# Altium project Motor Driver Board.PrjPcb
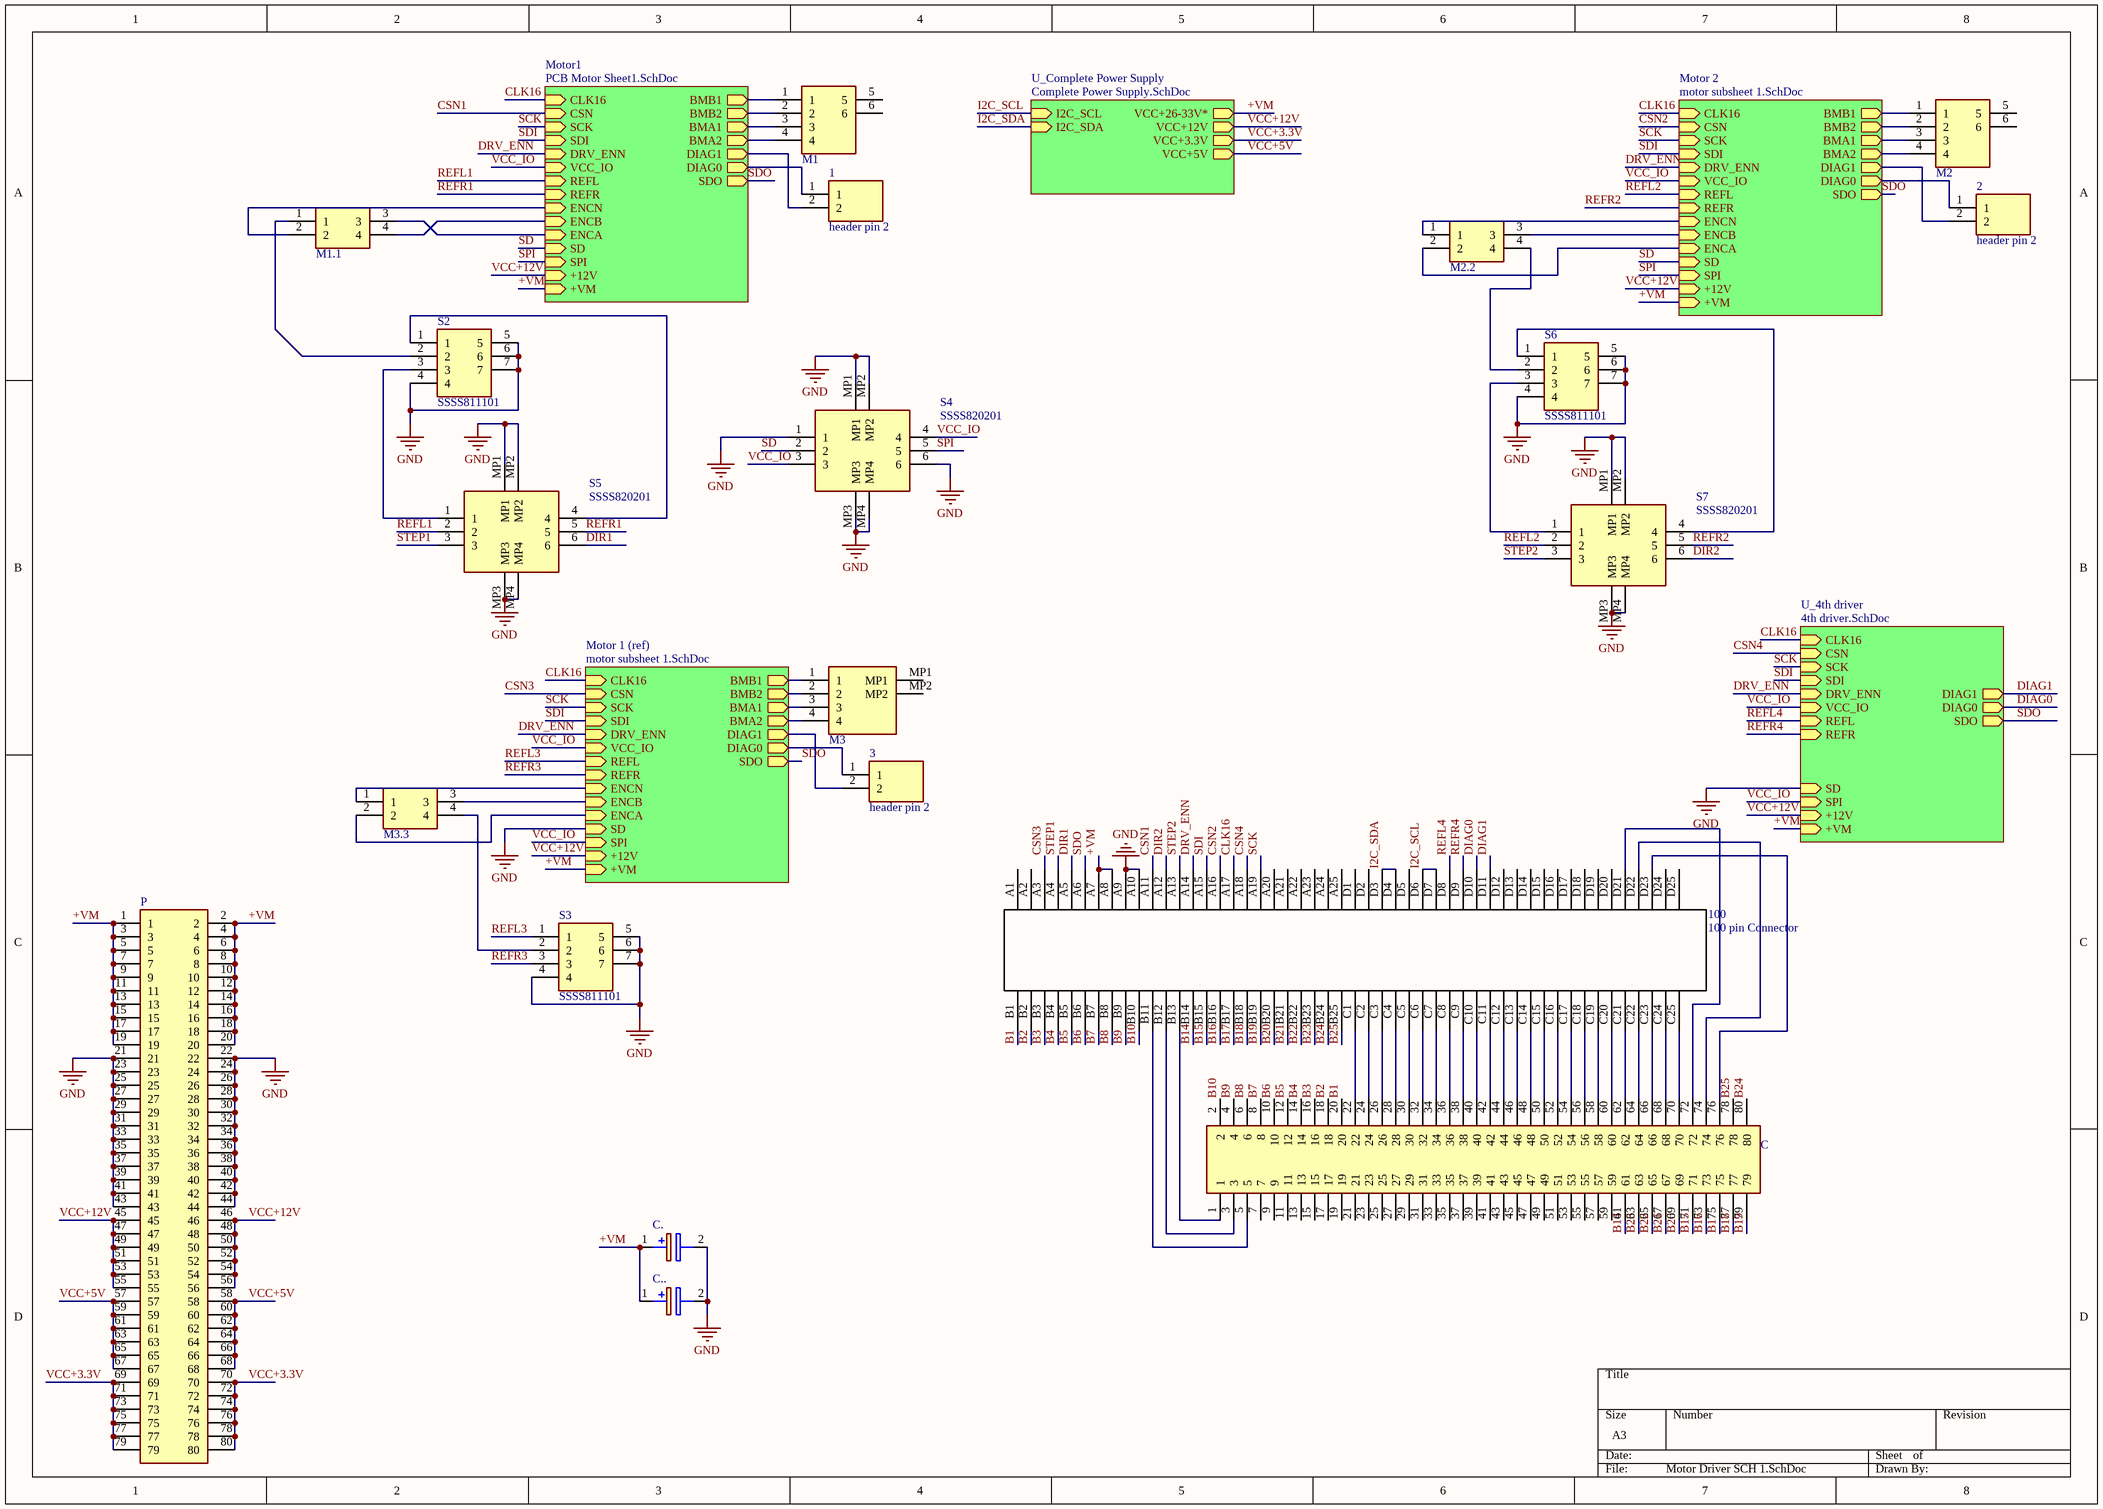
[diagram p0: Motor Driver SCH 1.SchDoc]
5 sheets, 214 parts. Net scope: hierarchical (ports join the sheet entries above them; power ports are global).
Board files: motor driver board PCB.PcbDoc, Dual Motor Driver.PcbDoc
Sheets:
  Motor Driver SCH 1.SchDoc
    Motor1 = PCB Motor Sheet1.SchDoc
    U_4th driver = 4th driver.SchDoc
    U_Complete Power Supply = Complete Power Supply.SchDoc
    Motor 2 = motor subsheet 1.SchDoc
    Motor 1 (ref) = motor subsheet 1.SchDoc

## Sheet Motor Driver SCH 1.SchDoc
size A3

### Parts
1  header pin 2  [2 pin header]
2  header pin 2  [2 pin header]
3  header pin 2  [2 pin header]
100  100 pin Connector  [SAMTEC_FOLC-125-M1-L-Q-LC]
C  5-5179180-3  [551791803]  (value not drawn)
C.  TPSD476M035R0300V  [CAPPM7344X310N]  (value not drawn)
C..  TPSD476M035R0300V  [CAPPM7344X310N]  (value not drawn)
M1  1778780  [1778780]  (value not drawn)
M1.1  SM04B-XSRS-ETB_LF__SN_  [SM04B-XSRS-ETB_2]  (value not drawn)
M2  1778780  [1778780]  (value not drawn)
M2.2  SM04B-XSRS-ETB_LF__SN_  [SM04B-XSRS-ETB_2]  (value not drawn)
M3  BM04B-ACHSS-A-GAN-TF_LF__SN_  [BM04BACHSSAGANTFLFSN]  (value not drawn)
M3.3  SM04B-XSRS-ETB_LF__SN_  [SM04B-XSRS-ETB_2]  (value not drawn)
P  5-5179180-3  [551791803]  (value not drawn)
S2  SSSS811101  [SSSS811101]
S3  SSSS811101  [SSSS811101]
S4  SSSS820201  [SSSS820201]
S5  SSSS820201  [SSSS820201]
S6  SSSS811101  [SSSS811101]
S7  SSSS820201  [SSSS820201]

### Sub-sheets
Motor1 = PCB Motor Sheet1.SchDoc: BMB1 (out), BMB2 (out), BMA1 (out), BMA2 (out), DIAG1 (out), DIAG0 (out), SDO (out), CLK16 (in), CSN (in), SCK (in), SDI (in), DRV_ENN (in), VCC_IO (in), REFL (in), REFR (in), ENCN (in), ENCB (in), ENCA (in), SD (in), +12V (in), +VM (in), SPI (in)
Motor 1 (ref) = motor subsheet 1.SchDoc: BMB1 (out), BMB2 (out), BMA1 (out), BMA2 (out), DIAG1 (out), DIAG0 (out), SDO (out), CLK16 (in), CSN (in), SCK (in), SDI (in), DRV_ENN (in), VCC_IO (in), REFL (in), REFR (in), ENCN (in), ENCB (in), ENCA (in), SD (in), +12V (in), +VM (in), SPI (in)
Motor 2 = motor subsheet 1.SchDoc: BMB1 (out), BMB2 (out), BMA1 (out), BMA2 (out), DIAG1 (out), DIAG0 (out), SDO (out), CLK16 (in), CSN (in), SCK (in), SDI (in), DRV_ENN (in), VCC_IO (in), REFL (in), REFR (in), ENCN (in), ENCB (in), ENCA (in), SD (in), +12V (in), +VM (in), SPI (in)
U_4th driver = 4th driver.SchDoc: DIAG1 (out), DIAG0 (out), SDO (out), CLK16 (in), CSN (in), SCK (in), SDI (in), DRV_ENN (in), VCC_IO (in), REFL (in), REFR (in), SD (in), +12V (in), +VM (in), SPI (in)
U_Complete Power Supply = Complete Power Supply.SchDoc: VCC+26-33V* (out), VCC+12V (out), VCC+3.3V (out), VCC+5V (out), I2C_SCL (in), I2C_SDA (in)

### Nets
+VM: 100.A7 100.A8 C..1(+) C...1(+) P.1 P.2 P.3 P.4 P.5 P.6 P.7 P.8 P.9 P.10 P.11 P.12 P.13 P.14 P.15 P.16 P.17 P.18 P.19 P.20 ; sheet Motor1/+VM, sheet U_4th driver/+VM, sheet U_Complete Power Supply/VCC+26-33V*, sheet Motor 2/+VM, sheet Motor 1 (ref)/+VM
GND: 100.A9 100.A10 C..2(-) C...2(-) P.21 P.22 P.23 P.24 P.25 P.26 P.27 P.28 P.29 P.30 P.31 P.32 P.33 P.34 P.35 P.36 P.37 P.38 P.39 P.40 P.41 P.42 P.43 P.44 S2.4 S2.5 S2.6 S2.7 S3.4 S3.5 S3.6 S3.7 S4.1 S4.6 S4.MP1 S4.MP2 S4.MP3 S4.MP4 S5.MP1 S5.MP2 S5.MP3 S5.MP4 S6.4 S6.5 S6.6 S6.7 S7.MP1 S7.MP2 S7.MP3 S7.MP4 ; sheet U_4th driver/SD, sheet Motor 1 (ref)/SD
VCC+3.3V: P.69 P.70 P.71 P.72 P.73 P.74 P.75 P.76 P.77 P.78 P.79 P.80 ; sheet U_Complete Power Supply/VCC+3.3V
VCC+5V: P.57 P.58 P.59 P.60 P.61 P.62 P.63 P.64 P.65 P.66 P.67 P.68 ; sheet U_Complete Power Supply/VCC+5V
VCC+12V: P.45 P.46 P.47 P.48 P.49 P.50 P.51 P.52 P.53 P.54 P.55 P.56 ; sheet Motor1/+12V, sheet U_4th driver/+12V, sheet U_Complete Power Supply/VCC+12V, sheet Motor 2/+12V, sheet Motor 1 (ref)/+12V
B1: 100.B1 C.20
B2: 100.B2 C.18
B3: 100.B3 C.16
B4: 100.B4 C.14
B5: 100.B5 C.12
B6: 100.B6 C.10
B7: 100.B7 C.8
B8: 100.B8 C.6
B9: 100.B9 C.4
B10: 100.B10 C.2
B14: 100.B14 C.61
B15: 100.B15 C.71
B16: 100.B16 C.73
B17: 100.B17 C.75
B18: 100.B18 C.77
B19: 100.B19 C.79
B20: 100.B20 C.69
B21: 100.B21 C.67
B22: 100.B22 C.65
B23: 100.B23 C.63
B24: 100.B24 C.80
B25: 100.B25 C.78
BMA1: M3.3 ; sheet Motor 1 (ref)/BMA1
BMA1: M1.3 ; sheet Motor1/BMA1  [a separate net that carries the same name]
BMA1: M2.3 ; sheet Motor 2/BMA1  [a separate net that carries the same name]
BMA2: M3.4 ; sheet Motor 1 (ref)/BMA2
BMA2: M1.4 ; sheet Motor1/BMA2  [a separate net that carries the same name]
BMA2: M2.4 ; sheet Motor 2/BMA2  [a separate net that carries the same name]
BMB1: M3.1 ; sheet Motor 1 (ref)/BMB1
BMB1: M1.1 ; sheet Motor1/BMB1  [a separate net that carries the same name]
BMB1: M2.1 ; sheet Motor 2/BMB1  [a separate net that carries the same name]
BMB2: M3.2 ; sheet Motor 1 (ref)/BMB2
BMB2: M1.2 ; sheet Motor1/BMB2  [a separate net that carries the same name]
BMB2: M2.2 ; sheet Motor 2/BMB2  [a separate net that carries the same name]
CLK16: 100.A17 ; sheet Motor1/CLK16, sheet U_4th driver/CLK16, sheet Motor 2/CLK16, sheet Motor 1 (ref)/CLK16
CSN1: 100.A11 ; sheet Motor1/CSN
CSN2: 100.A16 ; sheet Motor 2/CSN
CSN3: 100.A3 ; sheet Motor 1 (ref)/CSN
CSN4: 100.A18 ; sheet U_4th driver/CSN
DIAG0: 100.D10 ; sheet U_4th driver/DIAG0
DIAG1: 100.D11 ; sheet U_4th driver/DIAG1
DIR1: 100.A5 S5.6
DIR2: 100.A12 S7.6
DRV_ENN: 100.A14 ; sheet Motor1/DRV_ENN, sheet U_4th driver/DRV_ENN, sheet Motor 2/DRV_ENN, sheet Motor 1 (ref)/DRV_ENN
I2C_SCL: 100.D6 100.D7 ; sheet U_Complete Power Supply/I2C_SCL
I2C_SDA: 100.D3 100.D4 ; sheet U_Complete Power Supply/I2C_SDA
REFL1: S5.2 ; sheet Motor1/REFL
REFL2: S7.2 ; sheet Motor 2/REFL
REFL3: S3.1 ; sheet Motor 1 (ref)/REFL
REFL4: 100.D8 ; sheet U_4th driver/REFL
REFR1: S5.5 ; sheet Motor1/REFR
REFR2: S7.5 ; sheet Motor 2/REFR
REFR3: S3.3 ; sheet Motor 1 (ref)/REFR
REFR4: 100.D9 ; sheet U_4th driver/REFR
SCK: 100.A19 ; sheet Motor1/SCK, sheet U_4th driver/SCK, sheet Motor 2/SCK, sheet Motor 1 (ref)/SCK
SD: S4.2 ; sheet Motor1/SD, sheet Motor 2/SD
SDI: 100.A15 ; sheet Motor1/SDI, sheet U_4th driver/SDI, sheet Motor 2/SDI, sheet Motor 1 (ref)/SDI
SDO: 100.A6 ; sheet Motor1/SDO, sheet U_4th driver/SDO, sheet Motor 2/SDO, sheet Motor 1 (ref)/SDO
SPI: S4.5 ; sheet Motor1/SPI, sheet Motor 2/SPI
STEP1: 100.A4 S5.3
STEP2: 100.A13 S7.3
VCC_IO: S4.3 S4.4 ; sheet Motor1/VCC_IO, sheet U_4th driver/VCC_IO, sheet U_4th driver/SPI, sheet Motor 2/VCC_IO, sheet Motor 1 (ref)/VCC_IO, sheet Motor 1 (ref)/SPI
Net1_1: 1.1 ; sheet Motor1/DIAG0
Net1_2: 1.2 ; sheet Motor1/DIAG1
Net2_1: 2.1 ; sheet Motor 2/DIAG0
Net2_2: 2.2 ; sheet Motor 2/DIAG1
Net3_1: 3.1 ; sheet Motor 1 (ref)/DIAG0
Net3_2: 3.2 ; sheet Motor 1 (ref)/DIAG1
Net100_B11: 100.B11 C.5
Net100_B12: 100.B12 C.3
Net100_B13: 100.B13 C.1
Net100_C1: 100.C1 C.22
Net100_C2: 100.C2 C.24
Net100_C3: 100.C3 C.26
Net100_C4: 100.C4 C.28
Net100_C5: 100.C5 C.30
Net100_C6: 100.C6 C.32
Net100_C7: 100.C7 C.34
Net100_C8: 100.C8 C.36
Net100_C9: 100.C9 C.38
Net100_C10: 100.C10 C.40
Net100_C11: 100.C11 C.42
Net100_C12: 100.C12 C.44
Net100_C13: 100.C13 C.46
Net100_C14: 100.C14 C.48
Net100_C15: 100.C15 C.50
Net100_C16: 100.C16 C.52
Net100_C17: 100.C17 C.54
Net100_C18: 100.C18 C.56
Net100_C19: 100.C19 C.58
Net100_C20: 100.C20 C.60
Net100_C21: 100.C21 C.62
Net100_C22: 100.C22 C.64
Net100_C23: 100.C23 C.66
Net100_C24: 100.C24 C.68
Net100_C25: 100.C25 C.70
Net100_D21: 100.D21 C.72
Net100_D22: 100.D22 C.74
Net100_D23: 100.D23 C.76
NetIC1_23: M1.1.4 ; sheet Motor1/ENCB
NetIC1_24: M1.1.3 ; sheet Motor1/ENCA
NetIC1_25: M1.1.2 ; sheet Motor1/ENCN
NetIC1A_23: M2.2.3 ; sheet Motor 2/ENCB
NetIC1A_24: M2.2.2 ; sheet Motor 2/ENCA
NetIC1A_25: M2.2.1 ; sheet Motor 2/ENCN
NetIC1B_23: M3.3.3 ; sheet Motor 1 (ref)/ENCB
NetIC1B_24: M3.3.2 ; sheet Motor 1 (ref)/ENCA
NetIC1B_25: M3.3.1 ; sheet Motor 1 (ref)/ENCN
NetM1.1_1: M1.1.1 S2.2
NetM2.2_4: M2.2.4 S6.2
NetM3.3_4: M3.3.4 S3.2
NetS2_1: S2.1 S5.4
NetS2_3: S2.3 S5.1
NetS6_1: S6.1 S7.4
NetS6_3: S6.3 S7.1

Not connected (* = marked no-connect by the designer): 100 A1(26) A2(27) A20(45) A21(46) A22(47) A23(48) A24(49) A25(50) D1(101) D2(102) D5(105) D12(112) D13(113) D14(114) D15(115) D16(116) D17(117) D18(118) D19(119) D20(120) D24(124) D25(125); C 7 9 11 13 15 17 19 21 23 25 27 29 31 33 35 37 39 41 43 45 47 49 51 53 55 57 59; M1 5 6; M2 5 6; M3 MP1 MP2

### Library data of the parts
C P = 5-5179180-3: Connector; Manufacturer_Name: TE Connectivity; Datasheet Link: https://www.te.com/commerce/DocumentDelivery/DDEController?Action=showdoc&DocId=Customer+Drawing%7F5179180%7FD2%7Fpdf%7FEnglish%7FENG_CD_5179180_D2.pdf%7F5-5179180-3; Height: 8mm; Manufacturer_Part_Number: 5-5179180-3; Mouser Part Number: 571-5-5179180-3; Mouser Price/Stock: https://www.mouser.co.uk/ProductDetail/TE-Connectivity/5-5179180-3?qs=P2RFxj4culIYpw1CYdphOg%3D%3D; Arrow Part Number: 5-5179180-3; Arrow Price/Stock: https://www.arrow.com/en/products/5-5179180-3/te-connectivity
C. C.. = TPSD476M035R0300V: Capacitor Polarised; Manufacturer_Name: Kyocera AVX; Datasheet Link: https://componentsearchengine.com/Datasheets/2/TPSD476M035R0300V.pdf; Height: 3.1mm; Manufacturer_Part_Number: TPSD476M035R0300V; Mouser Part Number: 581-TPSD476M035R300V; Mouser Price/Stock: https://www.mouser.co.uk/ProductDetail/KYOCERA-AVX/TPSD476M035R0300V?qs=fAHHVMwC%252BbhHPnRCkY2ORg%3D%3D
M1 M2 = 1778780: Connector; Manufacturer_Name: Phoenix Contact; Datasheet Link: http://www.phoenixcontact.com/de/produkte/1778780/pdf; Height: 5.1mm; Manufacturer_Part_Number: 1778780; Mouser Part Number: 651-1778780; Mouser Price/Stock: https://www.mouser.co.uk/ProductDetail/Phoenix-Contact/1778780?qs=pYfYGt2amwkFYtacWTGMiw%3D%3D; Arrow Part Number: 1778780; Arrow Price/Stock: https://www.arrow.com/en/products/1778780/phoenix-contact?region=nac
M1.1 M2.2 M3.3 = SM04B-XSRS-ETB_LF__SN_: Connector; Manufacturer_Name: JST (JAPAN SOLDERLESS TERMINALS); Manufacturer_Part_Number: SM04B-XSRS-ETB(LF)(SN); Datasheet Link: https://datasheet.datasheetarchive.com/originals/distributors/Datasheets_SAMA/3d8b1bb9e73c0962bb93b166b87abb57.pdf
M3 = BM04B-ACHSS-A-GAN-TF_LF__SN_: Connector; Manufacturer_Name: JST (JAPAN SOLDERLESS TERMINALS); Manufacturer_Part_Number: BM04B-ACHSS-A-GAN-TF(LF)(SN); Datasheet Link: https://www.jst-mfg.com/product/pdf/eng/eACH.pdf; Height: 1.4mm
S2 S3 S6 = SSSS811101: Switch; Manufacturer_Name: ALPS Electric; Height: 1.6mm; Manufacturer_Part_Number: SSSS811101; Mouser Part Number: 688-SSSS811101; Mouser Price/Stock: https://www.mouser.co.uk/ProductDetail/Alps-Alpine/SSSS811101?qs=m0BA540hBPe%2FELmLcs%2FcCA%3D%3D; Arrow Part Number: SSSS811101; Arrow Price/Stock: https://www.arrow.com/en/products/ssss811101/alps-electric
S4 S5 S7 = SSSS820201: Switch; Manufacturer_Name: ALPS Electric; Datasheet Link: https://componentsearchengine.com/Datasheets/2/SSSS820201.pdf; Height: 2.9mm; Manufacturer_Part_Number: SSSS820201; Mouser Part Number: 688-SSSS820201; Mouser Price/Stock: https://www.mouser.co.uk/ProductDetail/Alps-Alpine/SSSS820201?qs=4nKZKRgDHlnI2QoAHm%252BpWA%3D%3D; Arrow Part Number: SSSS820201; Arrow Price/Stock: https://www.arrow.com/en/products/ssss820201/alps-electric?region=nac

## Sheet PCB Motor Sheet1.SchDoc
size A3
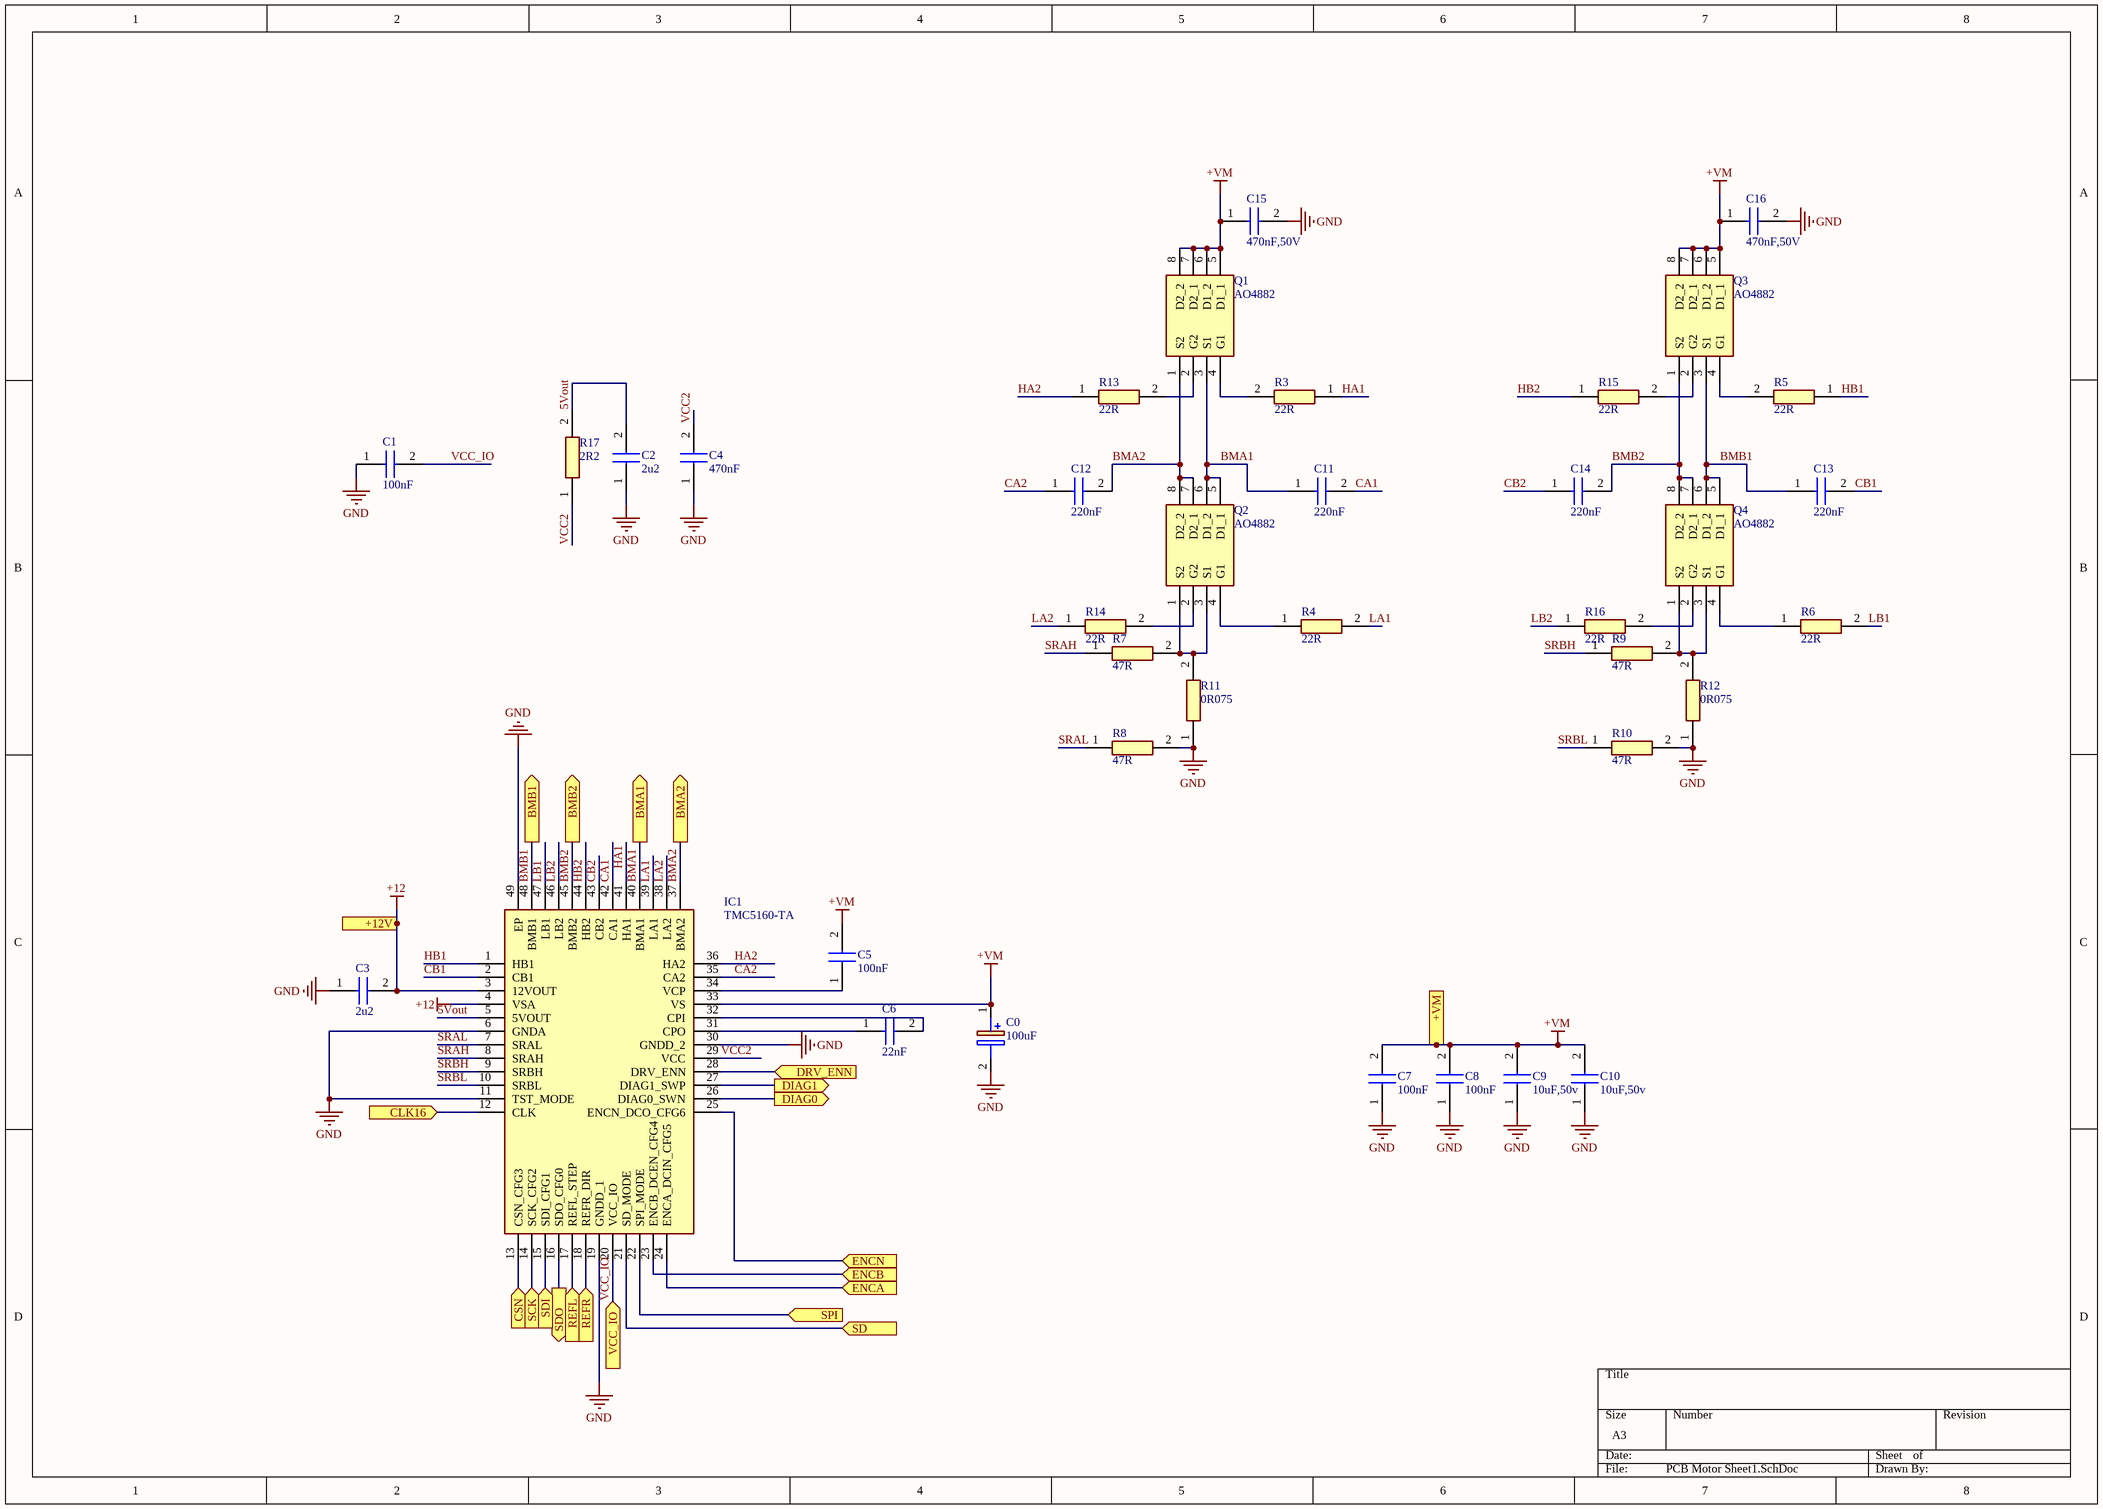
[diagram p1: PCB Motor Sheet1.SchDoc]

### Parts
C0  100uF  [CAPAE850X1050N]
C1  100nF  [CAPC1608X90N]
C2  2u2  [CAPC1608X90N]
C3  2u2  [CAPC1608X90N]
C4  470nF  [CAPC1608X90N]
C5  100nF  [CAPC1608X90N]
C6  22nF  [CAPC1608X90N]
C7  100nF  [CAPC1608X90N]
C8  100nF  [CAPC1608X90N]
C9  10uF,50v  [CAPC3216X180N]
C10  10uF,50v  [CAPC3216X180N]
C11  220nF  [CAPC1608X90N]
C12  220nF  [CAPC1608X90N]
C13  220nF  [CAPC1608X90N]
C14  220nF  [CAPC1608X90N]
C15  470nF,50V  [C1608_Commercial]
C16  470nF,50V  [C1608_Commercial]
IC1  TMC5160-TA  [QFP50P900X900X120-49N]
Q1  AO4882  [SOIC127P600X175-8N]
Q2  AO4882  [SOIC127P600X175-8N]
Q3  AO4882  [SOIC127P600X175-8N]
Q4  AO4882  [SOIC127P600X175-8N]
R3  22R  [RESC1608X55N]
R4  22R  [RESC1608X55N]
R5  22R  [RESC1608X55N]
R6  22R  [RESC1608X55N]
R7  47R  [RESC1608X60N]
R8  47R  [RESC1608X60N]
R9  47R  [RESC1608X60N]
R10  47R  [RESC1608X60N]
R11  0R075  [ERJ8_B_BW_R_LW_CW_D]
R12  0R075  [ERJ8_B_BW_R_LW_CW_D]
R13  22R  [RESC1608X55N]
R14  22R  [RESC1608X55N]
R15  22R  [RESC1608X55N]
R16  22R  [RESC1608X55N]
R17  2R2  [RESC1608X55N]

### Ports
+12V (in), +VM (in), BMA1 (out), BMA2 (out), BMB1 (out), BMB2 (out), CLK16 (in), CSN (in), DIAG0 (out), DIAG1 (out), DRV_ENN (in), ENCA (in), ENCB (in), ENCN (in), REFL (in), REFR (in), SCK (in), SD (in), SDI (in), SDO (out), SPI (in), VCC_IO (in)

### Nets
+12: C3.2 IC1.3(12VOUT) IC1.4(VSA) ; port +12V  [project net VCC+12V]
+VM: C0.1(+) C5.2 C7.2 C8.2 C9.2 C10.2 C15.1 C16.1 IC1.33(VS) Q1.5(D1_1) Q1.6(D1_2) Q1.7(D2_1) Q1.8(D2_2) Q3.5(D1_1) Q3.6(D1_2) Q3.7(D2_1) Q3.8(D2_2) ; port +VM
GND: C0.2(-) C1.1 C2.1 C3.1 C4.1 C7.1 C8.1 C9.1 C10.1 C15.2 C16.2 IC1.6(GNDA) IC1.11(TST_MODE) IC1.19(GNDD_1) IC1.30(GNDD_2) IC1.49(EP) R8.2 R10.2 R11.1 R12.1
5Vout: C2.2 IC1.5(5VOUT) R17.2
BMA1: C11.1 IC1.40(BMA1) Q1.3(S1) Q2.5(D1_1) Q2.6(D1_2) ; port BMA1
BMA2: C12.2 IC1.37(BMA2) Q1.1(S2) Q2.7(D2_1) Q2.8(D2_2) ; port BMA2
BMB1: C13.1 IC1.48(BMB1) Q3.3(S1) Q4.5(D1_1) Q4.6(D1_2) ; port BMB1
BMB2: C14.2 IC1.45(BMB2) Q3.1(S2) Q4.7(D2_1) Q4.8(D2_2) ; port BMB2
CA1: C11.2 IC1.42(CA1)
CA2: C12.1 IC1.35(CA2)
CB1: C13.2 IC1.2(CB1)
CB2: C14.1 IC1.43(CB2)
CLK16: IC1.12(CLK) ; port CLK16
CSN1: IC1.13(CSN_CFG3) ; port CSN
DRV_ENN: IC1.28(DRV_ENN) ; port DRV_ENN
HA1: IC1.41(HA1) R3.1
HA2: IC1.36(HA2) R13.1
HB1: IC1.1(HB1) R5.1
HB2: IC1.44(HB2) R15.1
LA1: IC1.39(LA1) R4.2
LA2: IC1.38(LA2) R14.1
LB1: IC1.47(LB1) R6.2
LB2: IC1.46(LB2) R16.1
REFL1: IC1.17(REFL_STEP) ; port REFL
REFR1: IC1.18(REFR_DIR) ; port REFR
SCK: IC1.14(SCK_CFG2) ; port SCK
SD: IC1.21(SD_MODE) ; port SD
SDI: IC1.15(SDI_CFG1) ; port SDI
SDO: IC1.16(SDO_CFG0) ; port SDO
SPI: IC1.22(SPI_MODE) ; port SPI
SRAH: IC1.8(SRAH) R7.1
SRAL: IC1.7(SRAL) R8.1
SRBH: IC1.9(SRBH) R9.1
SRBL: IC1.10(SRBL) R10.1
VCC2: C4.2 IC1.29(VCC) R17.1
VCC_IO: C1.2 IC1.20(VCC_IO) ; port VCC_IO
Net1_1: IC1.26(DIAG0_SWN) ; port DIAG0
Net1_2: IC1.27(DIAG1_SWP) ; port DIAG1
NetC5_1: C5.1 IC1.34(VCP)
NetC6_1: C6.1 IC1.31(CPO)
NetC6_2: C6.2 IC1.32(CPI)
NetIC1_23: IC1.23(ENCB_DCEN_CFG4) ; port ENCB
NetIC1_24: IC1.24(ENCA_DCIN_CFG5) ; port ENCA
NetIC1_25: IC1.25(ENCN_DCO_CFG6) ; port ENCN
NetQ1_2: Q1.2(G2) R13.2
NetQ1_4: Q1.4(G1) R3.2
NetQ2_1: Q2.1(S2) Q2.3(S1) R7.2 R11.2
NetQ2_2: Q2.2(G2) R14.2
NetQ2_4: Q2.4(G1) R4.1
NetQ3_2: Q3.2(G2) R15.2
NetQ3_4: Q3.4(G1) R5.2
NetQ4_1: Q4.1(S2) Q4.3(S1) R9.2 R12.2
NetQ4_2: Q4.2(G2) R16.2
NetQ4_4: Q4.4(G1) R6.1

### Library data of the parts
C0 = MAL215097011E3: Capacitor Polarised / MAL215097011E3; Manufacturer_Name: Vishay; Datasheet Link: http://www.vishay.com/docs/28395/150crz.pdf; Height: 10.5mm; Manufacturer_Part_Number: MAL215097011E3; Mouser Part Number: 594-MAL215097011E3; Mouser Price/Stock: https://www.mouser.co.uk/ProductDetail/Vishay-BC-Components/MAL215097011E3?qs=qmStTZH4TzmmMfVG5I6TQQ%3D%3D; Arrow Part Number: MAL215097011E3; Arrow Price/Stock: https://www.arrow.com/en/products/mal215097011e3/vishay
C1-C8 C11-C14 = GCM188R71H224KA64D: Capacitor; Manufacturer_Name: Murata Electronics; Datasheet Link: https://psearch.en.murata.com/capacitor/product/GCM188R71H224KA64%23.html; Height: 0.9mm; Manufacturer_Part_Number: GCM188R71H224KA64D; Mouser Part Number: 81-GCM188R71H224K64D; Mouser Price/Stock: https://www.mouser.co.uk/ProductDetail/Murata-Electronics/GCM188R71H224KA64D?qs=Kk8YaIHLBVBgtUYYs%2FZrtQ%3D%3D; Arrow Part Number: GCM188R71H224KA64D; Arrow Price/Stock: https://www.arrow.com/en/products/gcm188r71h224ka64d/murata-manufacturing
  C1 C5 C7 C8: LCSC Part #: C161181
  C2: LCSC Part #: C77047
  C3: LCSC Part #: *
  C4: LCSC Part #: C170149
  C6: LCSC Part #: C354353
  C11-C14: LCSC Part #: C97857
C9 C10 = GRM31CR61H106MA12L: Capacitor; Manufacturer_Name: Murata Electronics; Datasheet Link: https://datasheet.datasheetarchive.com/originals/distributors/DKDS-10/192395.pdf; Height: 1.8mm; Manufacturer_Part_Number: GRM31CR61H106MA12L; Mouser Part Number: 81-GRM31CR61H106MA2L; Mouser Price/Stock: https://www.mouser.co.uk/ProductDetail/Murata-Electronics/GRM31CR61H106MA12L/?qs=eeBpzGFlv%252B9KISFXBDHybg%3D%3D; Arrow Part Number: GRM31CR61H106MA12L; Arrow Price/Stock: https://www.arrow.com/en/products/grm31cr61h106ma12l/murata-manufacturing?region=europe; LCSC Part #: C882507
C15 C16 = C1608X7R1H474K080AC: Capacitor; Manufacturer_Name: TDK; Datasheet Link: https://product.tdk.com/system/files/dam/doc/product/capacitor/ceramic/mlcc/catalog/mlcc_commercial_general_en.pdf; Height: 0.9mm; Manufacturer_Part_Number: C1608X7R1H474K080AC; Mouser Part Number: 810-C1608X7R1H474K; Mouser Price/Stock: https://www.mouser.co.uk/ProductDetail/TDK/C1608X7R1H474K080AC?qs=NRhsANhppD8WKA9kPBtdag%3D%3D; LCSC Part #: C170149
IC1 = TMC5160-TA: Integrated Circuit; Manufacturer_Name: TRINAMIC; Datasheet Link: https://datasheet.datasheetarchive.com/originals/distributors/DKDS-40/47761.pdf; Height: 1.2mm; Manufacturer_Part_Number: TMC5160-TA; LCSC Part #: C516354
Q1-Q4 = AO4882: MOSFET (N-Channel); Manufacturer_Name: Alpha & Omega Semiconductors; Datasheet Link: http://www.aosmd.com/res/data_sheets/AO4882.pdf; Height: 1.75mm; Manufacturer_Part_Number: AO4882; Arrow Part Number: AO4882; Arrow Price/Stock: https://www.arrow.com/en/products/ao4882/alpha-and-omega-semiconductor?region=nac; LCSC Part #: C3040598
R3-R6 R13-R17 = MC0063W06031100K: Resistor; Manufacturer_Name: MULTICOMP; Datasheet Link: http://uk.farnell.com/multicomp/mc0063w06031105k/res-thick-film-105k-1-0-063w-0603/dp/1170988; Height: 0.55mm; Manufacturer_Part_Number: MC0063W06031100K
  R3-R6 R13-R16: LCSC Part #: C122707
  R17: LCSC Part #: C269422
R7-R10 = MCSR06X47R0FTL: Resistor; Manufacturer_Name: MULTICOMP; Datasheet Link: http://www.farnell.com/datasheets/1716710.pdf?_ga=1.256651403.1411154270.1472651675; Height: 0.6mm; Manufacturer_Part_Number: MCSR06X47R0FTL; LCSC Part #: C2136913
R11 R12 = ERJ-8BWFR075V: Resistor; Manufacturer_Name: Panasonic; Datasheet Link: http://industrial.panasonic.com/cdbs/www-data/pdf/RDN0000/AOA0000C313.pdf; Manufacturer_Part_Number: ERJ-8BWFR075V; Mouser Part Number: 667-ERJ-8BWFR075V; Mouser Price/Stock: https://www.mouser.co.uk/ProductDetail/Panasonic/ERJ-8BWFR075V?qs=KH2o3k57USiX44P74%2FQfRA%3D%3D; Arrow Part Number: ERJ-8BWFR075V; Arrow Price/Stock: https://www.arrow.com/en/products/erj-8bwfr075v/panasonic; LCSC Part #: C388441

## Sheet 4th driver.SchDoc
size A3
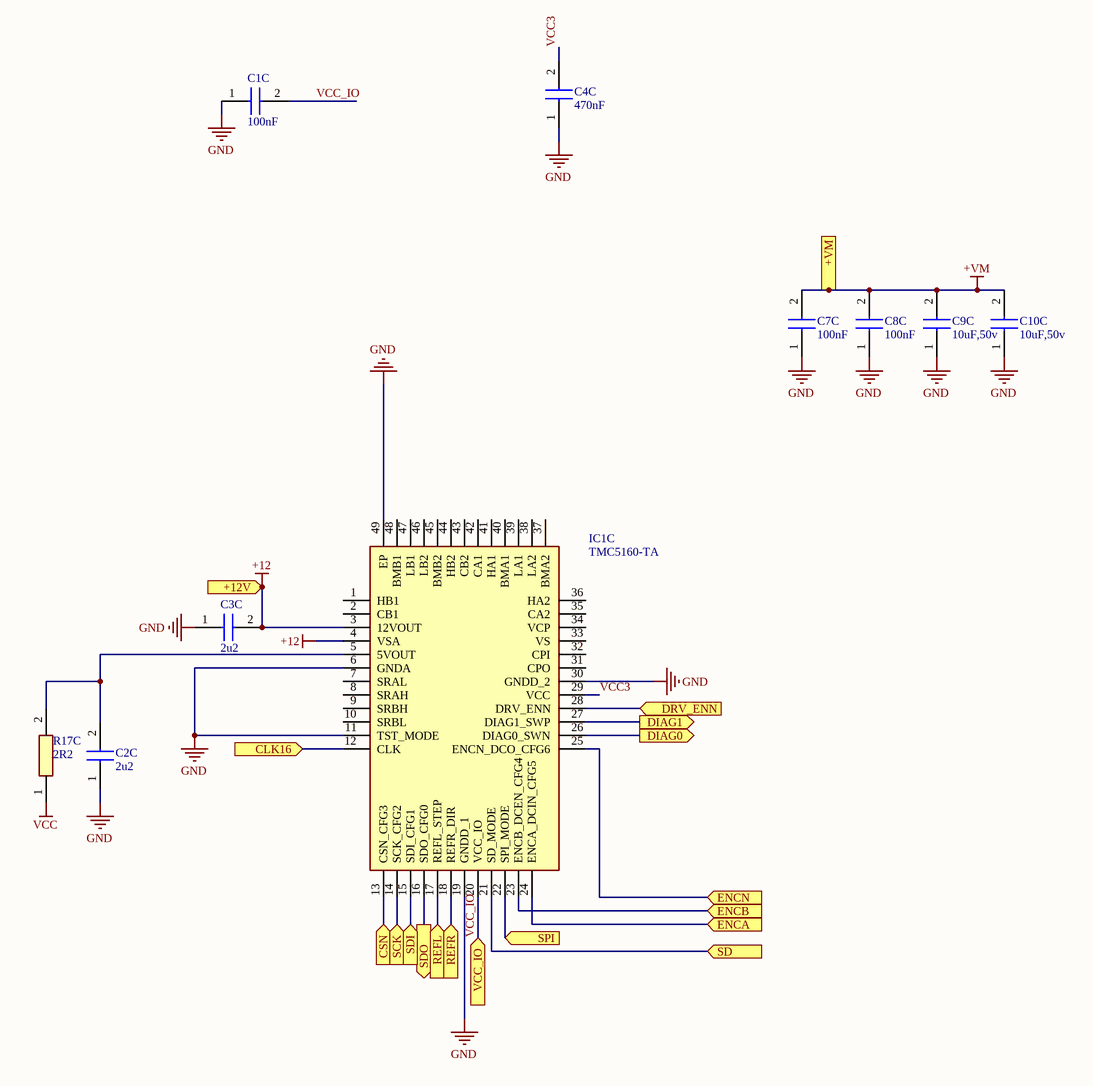
[diagram p2: 4th driver.SchDoc]

### Parts
C1C  100nF  [CAPC1608X90N]
C2C  2u2  [CAPC1608X90N]
C3C  2u2  [CAPC1608X90N]
C4C  470nF  [CAPC1608X90N]
C7C  100nF  [CAPC1608X90N]
C8C  100nF  [CAPC1608X90N]
C9C  10uF,50v  [CAPC3216X180N]
C10C  10uF,50v  [CAPC3216X180N]
IC1C  TMC5160-TA  [QFP50P900X900X120-49N]
R17C  2R2  [RESC1608X55N]

### Ports
+12V (in), +VM (in), CLK16 (in), CSN (in), DIAG0 (out), DIAG1 (out), DRV_ENN (in), ENCA (in), ENCB (in), ENCN (in), REFL (in), REFR (in), SCK (in), SD (in), SDI (in), SDO (out), SPI (in), VCC_IO (in)

### Nets
+12: C3C.2 IC1C.3(12VOUT) IC1C.4(VSA) ; port +12V  [project net VCC+12V]
+VM: C7C.2 C8C.2 C9C.2 C10C.2 ; port +VM
GND: C1C.1 C2C.1 C3C.1 C4C.1 C7C.1 C8C.1 C9C.1 C10C.1 IC1C.6(GNDA) IC1C.11(TST_MODE) IC1C.19(GNDD_1) IC1C.21(SD_MODE) IC1C.30(GNDD_2) IC1C.49(EP) ; port SD
VCC: R17C.1
CLK16: IC1C.12(CLK) ; port CLK16
CSN4: IC1C.13(CSN_CFG3) ; port CSN
DIAG0: IC1C.26(DIAG0_SWN) ; port DIAG0
DIAG1: IC1C.27(DIAG1_SWP) ; port DIAG1
DRV_ENN: IC1C.28(DRV_ENN) ; port DRV_ENN
REFL4: IC1C.17(REFL_STEP) ; port REFL
REFR4: IC1C.18(REFR_DIR) ; port REFR
SCK: IC1C.14(SCK_CFG2) ; port SCK
SDI: IC1C.15(SDI_CFG1) ; port SDI
SDO: IC1C.16(SDO_CFG0) ; port SDO
VCC3: C4C.2 IC1C.29(VCC)
VCC_IO: C1C.2 IC1C.20(VCC_IO) IC1C.22(SPI_MODE) ; port VCC_IO, port SPI
NetC2C_2: C2C.2 IC1C.5(5VOUT) R17C.2
NetIC1C_23: IC1C.23(ENCB_DCEN_CFG4) ; port ENCB
NetIC1C_24: IC1C.24(ENCA_DCIN_CFG5) ; port ENCA
NetIC1C_25: IC1C.25(ENCN_DCO_CFG6) ; port ENCN

Not connected (* = marked no-connect by the designer): IC1C 1(HB1) 2(CB1) 7(SRAL) 8(SRAH) 9(SRBH) 10(SRBL) 31(CPO) 32(CPI) 33(VS) 34(VCP) 35(CA2) 36(HA2) 37(BMA2) 38(LA2) 39(LA1) 40(BMA1) 41(HA1) 42(CA1) 43(CB2) 44(HB2) 45(BMB2) 46(LB2) 47(LB1) 48(BMB1)

### Library data of the parts
C1C C2C C3C C4C C7C C8C = GCM188R71H224KA64D: as C1 on sheet PCB Motor Sheet1; Datasheet Link: https://psearch.en.murata.com/capacitor/product/GCM188R71H224KA64%23.html; Height: 0.9mm; Manufacturer_Part_Number: GCM188R71H224KA64D; Mouser Part Number: 81-GCM188R71H224K64D; Mouser Price/Stock: https://www.mouser.co.uk/ProductDetail/Murata-Electronics/GCM188R71H224KA64D?qs=Kk8YaIHLBVBgtUYYs%2FZrtQ%3D%3D; Arrow Part Number: GCM188R71H224KA64D; Arrow Price/Stock: https://www.arrow.com/en/products/gcm188r71h224ka64d/murata-manufacturing
  C1C C7C C8C: LCSC Part #: C161181
  C2C: LCSC Part #: C77047
  C3C: LCSC Part #: *
  C4C: LCSC Part #: C170149
C9C C10C = GRM31CR61H106MA12L: as C9 on sheet PCB Motor Sheet1; Datasheet Link: https://datasheet.datasheetarchive.com/originals/distributors/DKDS-10/192395.pdf; Height: 1.8mm; Manufacturer_Part_Number: GRM31CR61H106MA12L; Mouser Part Number: 81-GRM31CR61H106MA2L; Mouser Price/Stock: https://www.mouser.co.uk/ProductDetail/Murata-Electronics/GRM31CR61H106MA12L/?qs=eeBpzGFlv%252B9KISFXBDHybg%3D%3D; Arrow Part Number: GRM31CR61H106MA12L; Arrow Price/Stock: https://www.arrow.com/en/products/grm31cr61h106ma12l/murata-manufacturing?region=europe; LCSC Part #: C882507
IC1C = TMC5160-TA: as IC1 on sheet PCB Motor Sheet1; Datasheet Link: https://datasheet.datasheetarchive.com/originals/distributors/DKDS-40/47761.pdf; Height: 1.2mm; Manufacturer_Part_Number: TMC5160-TA; LCSC Part #: C516354
R17C = MC0063W06031100K: Resistor; Manufacturer_Name: MULTICOMP; Datasheet Link: http://uk.farnell.com/multicomp/mc0063w06031105k/res-thick-film-105k-1-0-063w-0603/dp/1170988; Height: 0.55mm; Manufacturer_Part_Number: MC0063W06031100K; LCSC Part #: C269422

## Sheet Complete Power Supply.SchDoc
size A3
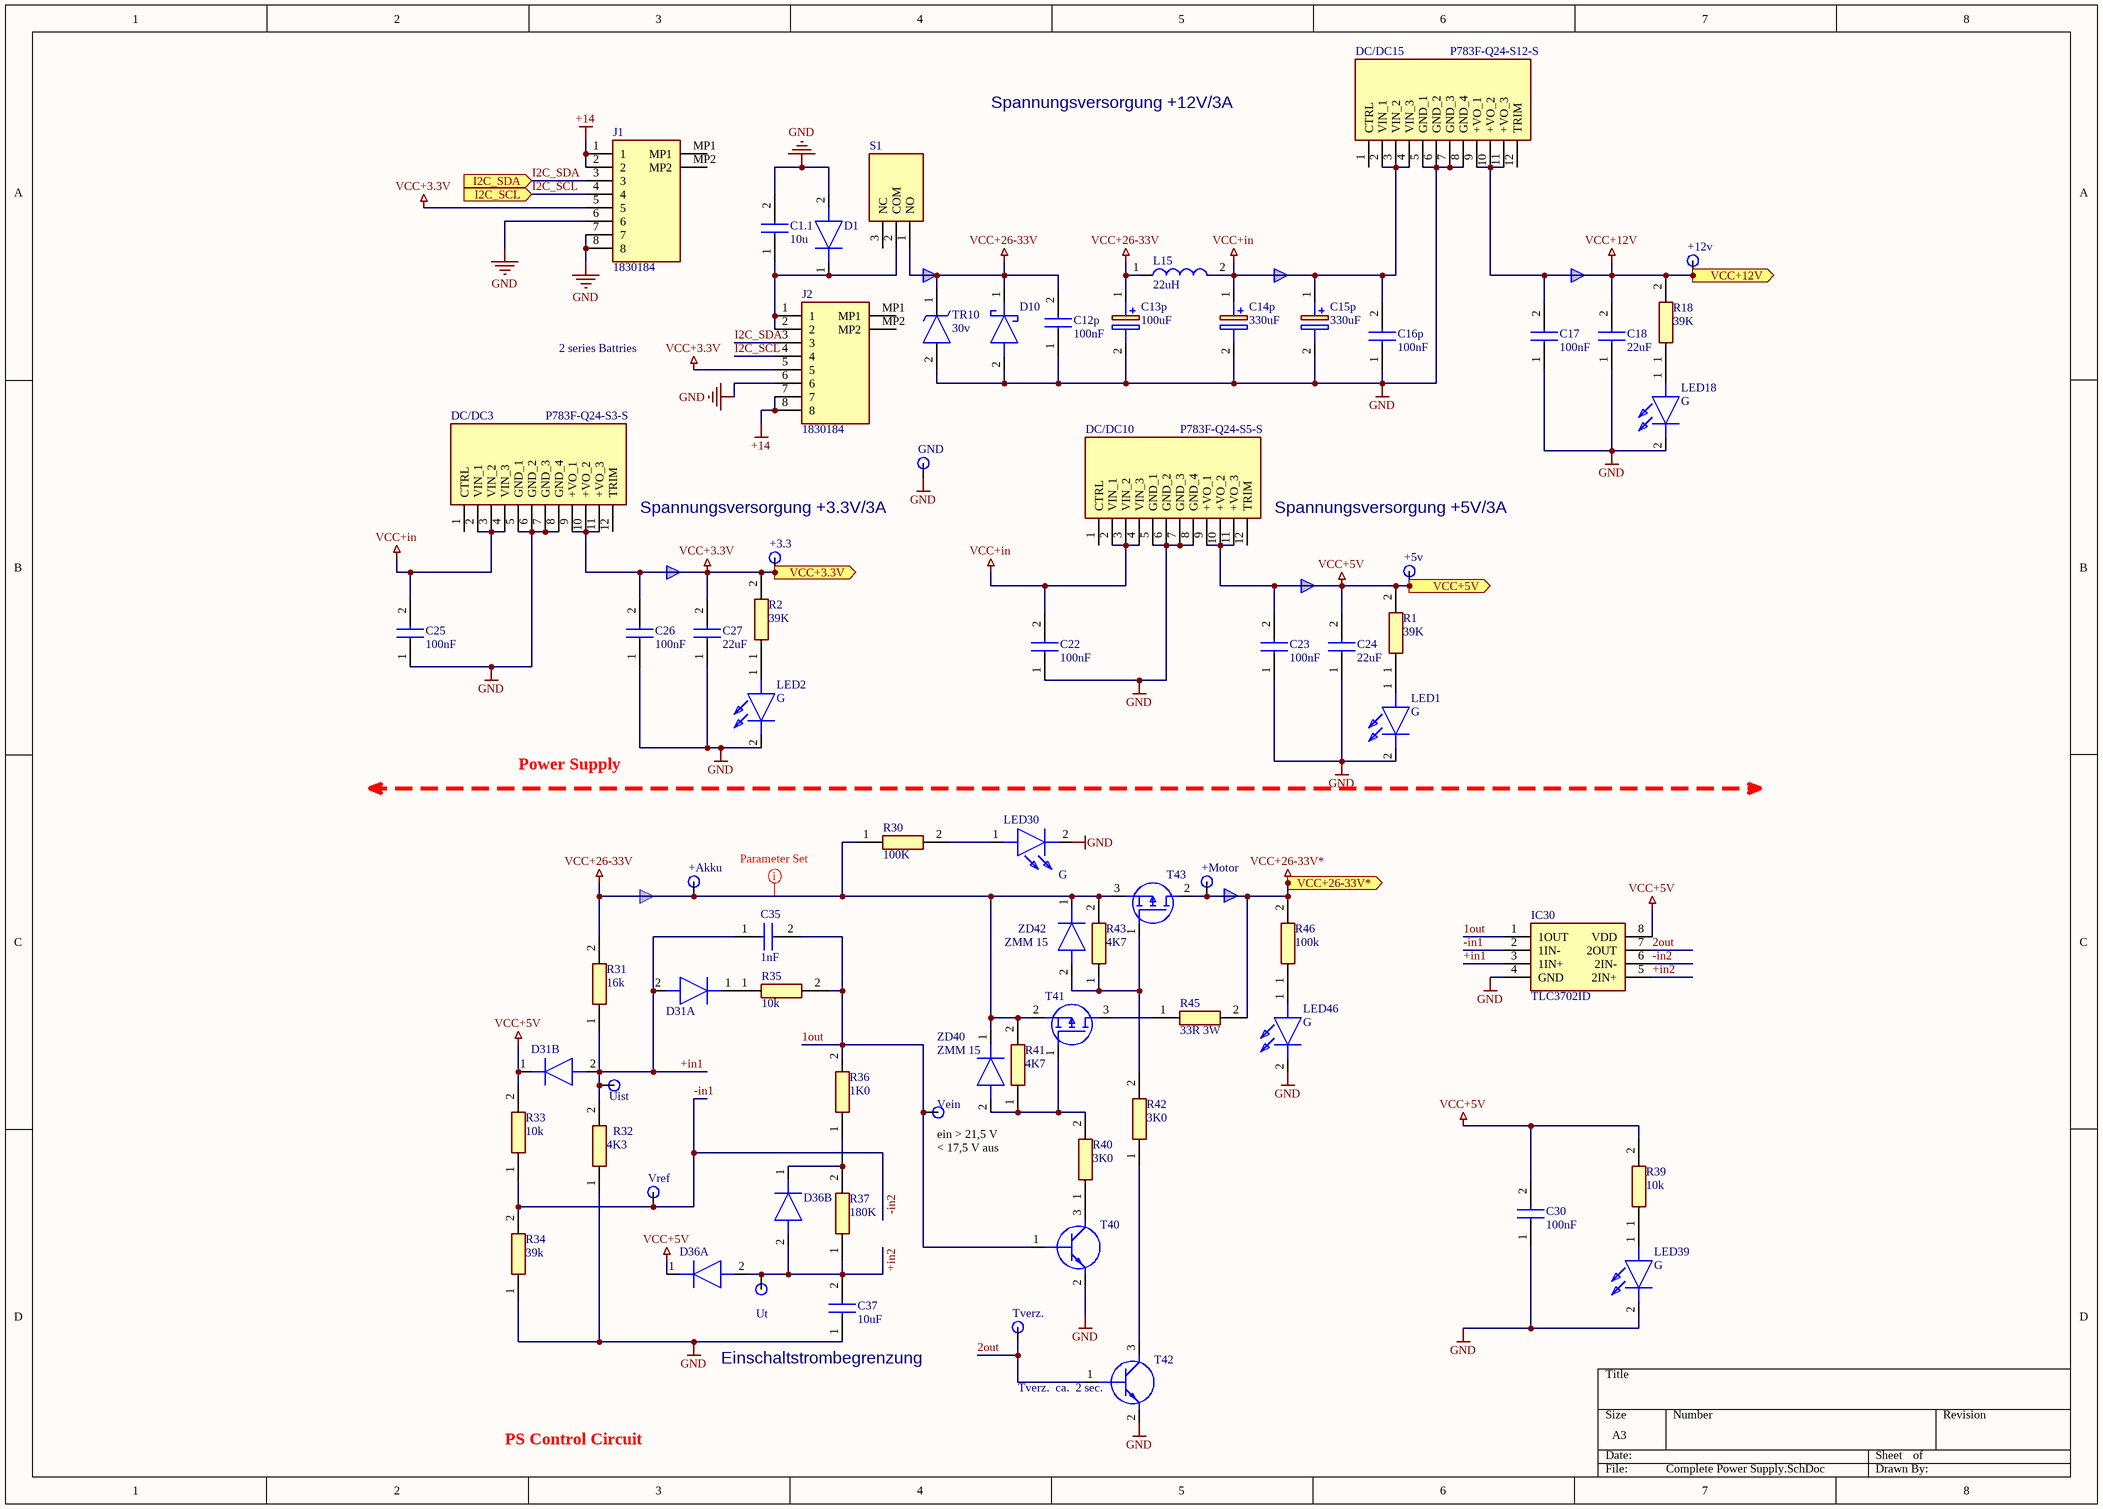
[diagram p3: Complete Power Supply.SchDoc]

### Parts
+3.3  TP  [TP]  (value not drawn)
+5v  TP  [TP]  (value not drawn)
+12v  TP  [TP]  (value not drawn)
+Akku  TP  [TP]  (value not drawn)
+Motor  TP  [TP]  (value not drawn)
C1.1  10u  [CAPC3216X180N]
C12p  100nF  [CAPC1608X90N]
C13p  100uF  [CAPPRD350W50D800H1750]
C14p  330uF  [CAPPRD500W60D1050H1750]
C15p  330uF  [CAPPRD500W60D1050H1750]
C16p  100nF  [CAPC1608X90N]
C17  100nF  [CAPC1608X90N]
C18  22uF  [CAPC3216X180N]
C22  100nF  [CAPC1608X90N]
C23  100nF  [CAPC1608X90N]
C24  22uF  [CAPC3216X180N]
C25  100nF  [CAPC1608X90N]
C26  100nF  [CAPC1608X90N]
C27  22uF  [CAPC3216X180N]
C30  100nF  [CAPC1608X90N]
C35  1nF  [CAPC1608X90N]
C37  10uF  [CAPC1608X90N]
D1  SM6T39A  [SMBJ36CATR]  (value not drawn)
D10  (no value)  [DIOM8059X295N]
D31A  BAS3010A03WE6327HTSA1  [SOD2513X110N]  (value not drawn)
D31B  BAS3010A03WE6327HTSA1  [SOD2513X110N]  (value not drawn)
D36A  BAS3010A03WE6327HTSA1  [SOD2513X110N]  (value not drawn)
D36B  BAS3010A03WE6327HTSA1  [SOD2513X110N]  (value not drawn)
DC/DC3  P783F-Q24-S3-S  [P783FQ24S12S]
DC/DC10  P783F-Q24-S5-S  [P783FQ24S12S]
DC/DC15  P783F-Q24-S12-S  [P783FQ24S12S]
GND  TP  [TP]  (value not drawn)
IC30  TLC3702ID  [SOIC127P600X175-8N]
J1  1830184  [1830184]
J2  1830184  [1830184]
L15  22uH  [INDPM7366X300N]
LED1  G  [KP2012SGD]
LED2  G  [KP2012SGD]
LED18  G  [KP2012SGD]
LED30  G  [KP2012SGD]
LED39  G  [KP2012SGD]
LED46  G  [KP2012SGD]
R1  39K  [RESC2012X65N]
R2  39K  [RESC2012X65N]
R18  39K  [RESC2012X65N]
R30  100K  [RESC2012X65N]
R31  16k  [RESC1608X60N]
R32  4K3  [RESC1608X60N]
R33  10k  [RESC1608X60N]
R34  39k  [RESC1608X60N]
R35  10k  [RESC1608X60N]
R36  1K0  [RESC1608X60N]
R37  180K  [RESC1608X60N]
R39  10k  [RESC2012X65N]
R40  3K0  [RESC1608X60N]
R41  4K7  [RESC1608X60N]
R42  3K0  [RESC1608X60N]
R43  4K7  [RESC1608X60N]
R45  33R 3W  [ERJ8_B_BW_R_LW_CW_D]
R46  100k  [RESC2012X65N]
S1  1-1825137-1  [118251371]  (value not drawn)
T40  BCR135WH6327XTSA1  [SOT65P210X100-3N]  (value not drawn)
T41  AO3407A  [SOT95P280X125-3N]  (value not drawn)
T42  BCR135WH6327XTSA1  [SOT65P210X100-3N]  (value not drawn)
T43  AUIRF9Z34N  [TO254P482X1016X2192-3P]  (value not drawn)
TR10  30v  [DIOM7959X262N]
Tverz.  TP  [TP]  (value not drawn)
Uist  TP  [TP]  (value not drawn)
Ut  TP  [TP]  (value not drawn)
Vein  TP  [TP]  (value not drawn)
Vref  TP  [TP]  (value not drawn)
ZD40  ZMM 15  [BZT55B13GS08]
ZD42  ZMM 15  [BZT55B13GS08]

### Ports
I2C_SCL (in), I2C_SDA (in), VCC+3.3V (out), VCC+5V (out), VCC+12V (out), VCC+26-33V* (out)

### Nets
+14: J1.1 J1.2 J2.7 J2.8
GND: C1.1.2 C12p.1 C13p.2(-) C14p.2(-) C15p.2(-) C16p.1 C17.1 C18.1 C22.1 C23.1 C24.1 C25.1 C26.1 C27.1 C30.1 C37.1 D1.2(A) D10.2(A) DC/DC3.5(GND_1) DC/DC3.6(GND_2) DC/DC3.7(GND_3) DC/DC3.8(GND_4) DC/DC10.5(GND_1) DC/DC10.6(GND_2) DC/DC10.7(GND_3) DC/DC10.8(GND_4) DC/DC15.5(GND_1) DC/DC15.6(GND_2) DC/DC15.7(GND_3) DC/DC15.8(GND_4) GND.25 IC30.4(GND) J1.6 J1.7 J1.8 J2.6 LED1.2(K) LED2.2(K) LED18.2(K) LED30.2(K) LED39.2(K) LED46.2(K) R32.1 R34.1 T40.2(E) T42.2(E) TR10.2(A)
VCC+3.3V: +3.3.25 C26.2 C27.2 DC/DC3.9(+VO_1) DC/DC3.10(+VO_2) DC/DC3.11(+VO_3) J1.5 J2.5 R2.2 ; port VCC+3.3V
VCC+5V: +5v.25 C23.2 C24.2 C30.2 D31B.1(K) D36A.1(K) DC/DC10.9(+VO_1) DC/DC10.10(+VO_2) DC/DC10.11(+VO_3) IC30.8(VDD) R1.2 R33.2 R39.2 ; port VCC+5V
VCC+12V: +12v.25 C17.2 C18.2 DC/DC15.9(+VO_1) DC/DC15.10(+VO_2) DC/DC15.11(+VO_3) R18.2 ; port VCC+12V
VCC+26-33V: +Akku.25 C12p.2 C13p.1(+) D10.1(K) L15.1 R30.1 R31.2 R41.2 R43.2 S1.1(NO) T41.2(S) T43.3(S) TR10.1(K) ZD40.1(K) ZD42.1(K)
VCC+26-33V*: +Motor.25 R45.2 R46.2 T43.2(D) ; port VCC+26-33V*  [project net +VM]
VCC+in: C14p.1(+) C15p.1(+) C16p.2 C22.2 C25.2 DC/DC3.2(VIN_1) DC/DC3.3(VIN_2) DC/DC3.4(VIN_3) DC/DC10.2(VIN_1) DC/DC10.3(VIN_2) DC/DC10.4(VIN_3) DC/DC15.2(VIN_1) DC/DC15.3(VIN_2) DC/DC15.4(VIN_3) L15.2
1out: C35.2 IC30.1(1OUT) R35.2 R36.2 T40.1(B) Vein.25
2out: IC30.7(2OUT) T42.1(B) Tverz..25
+in1: C35.1 D31A.2(A) D31B.2(A) IC30.3(1IN+) R31.1 R32.2 Uist.25
+in2: C37.2 D36A.2(A) D36B.2(A) IC30.5(2IN+) R37.1 Ut.25
-in1: IC30.2(1IN-) IC30.6(2IN-) R33.1 R34.2 Vref.25  [also labelled -in2]
I2C_SCL: J1.4 J2.4 ; port I2C_SCL
I2C_SDA: J1.3 J2.3 ; port I2C_SDA
NetC1.1_1: C1.1.1 D1.1(K) J2.1 J2.2 S1.2(COM)
NetD31A_1: D31A.1(K) R35.1
NetD36B_1: D36B.1(K) R36.1 R37.2
NetLED1_1: LED1.1(A) R1.1
NetLED2_1: LED2.1(A) R2.1
NetLED18_1: LED18.1(A) R18.1
NetLED30_1: LED30.1(A) R30.2
NetLED39_1: LED39.1(A) R39.1
NetLED46_1: LED46.1(A) R46.1
NetR40_1: R40.1 T40.3(C)
NetR40_2: R40.2 R41.1 T41.1(G) ZD40.2(A)
NetR42_1: R42.1 T42.3(C)
NetR42_2: R42.2 R43.1 T43.1(G) ZD42.2(A)
NetR45_1: R45.1 T41.3(D)

Not connected (* = marked no-connect by the designer): DC/DC3 1(CTRL) 12(TRIM); DC/DC10 1(CTRL) 12(TRIM); DC/DC15 1(CTRL) 12(TRIM); J1 MP1 MP2; J2 MP1 MP2; S1 3(NC)

### Layout directives
rule Clearance Constraint [Generic clearance = 0.2mm, and 9 value(s) for objects]: VCC+26-33V

### Notes on the sheet
- Spannungsversorgung +12V/3A
- 2 series Battries
- Spannungsversorgung +3.3V/3A
- (near DC/DC10) Spannungsversorgung +5V/3A
- Power Supply
- (near Vein) ein > 21,5 V
  < 17,5 V aus
- (near C37) Einschaltstrombegrenzung
- (near T42) Tverz.  ca.  2 sec.
- PS Control Circuit

### Library data of the parts
C1.1 = CL31A106KBHNNNE: Capacitor / CL31A106KBHNNNE; Manufacturer_Name: Samsung Electro-Mechanics; Datasheet Link: https://datasheet.datasheetarchive.com/originals/distributors/Datasheets_SAMA/08745f6325ae1679773301b11fb0567f.pdf; Height: 1.8mm; Manufacturer_Part_Number: CL31A106KBHNNNE; Mouser Part Number: 187-CL31A106KBHNNNE; Mouser Price/Stock: https://www.mouser.co.uk/ProductDetail/Samsung-Electro-Mechanics/CL31A106KBHNNNE?qs=X6jEic%2FHinBsSMnC%2FFnmbg%3D%3D; Arrow Part Number: CL31A106KBHNNNE; Arrow Price/Stock: https://www.arrow.com/en/products/cl31a106kbhnnne/samsung-electro-mechanics?region=nac
C12p C16p C17 C22 C23 C25 C26 C30 C35 C37 = GRM188R61E225KA12D: Capacitor / GRM188R61E225KA12D / 0603; Manufacturer_Name: Murata Electronics; Datasheet Link: https://psearch.en.murata.com/capacitor/product/GRM188R61E225KA12%23.html; Height: 0.9mm; Manufacturer_Part_Number: GRM188R61E225KA12D; Mouser Part Number: 81-GRM188R61E225KA2D; Mouser Price/Stock: https://www.mouser.co.uk/ProductDetail/Murata-Electronics/GRM188R61E225KA12D?qs=O5cugoO6nwcBgNVhHiS2FA%3D%3D; Arrow Part Number: GRM188R61E225KA12D; Arrow Price/Stock: https://www.arrow.com/en/products/grm188r61e225ka12d/murata-manufacturing?region=nac; LCSC Part #: C77047
C13p = 860080274012: Capacitor Polarised; Manufacturer_Name: Wurth Elektronik; Datasheet Link: https://www.we-online.de/katalog/datasheet/860080274012.pdf; Height: 17.5mm; Manufacturer_Part_Number: 860080274012
C14p C15p = 25YXF470M10X16: Capacitor Polarised; Manufacturer_Name: Rubycon; Datasheet Link: https://datasheet.octopart.com/25YXF470M10X16-Rubycon-datasheet-5377913.pdf; Height: 17.5mm; Manufacturer_Part_Number: 25YXF470M10X16
C18 C24 C27 = GRM31CR61H106MA12L: Capacitor / GRM31CR61H106MA12L / 1206; Manufacturer_Name: Murata Electronics; Datasheet Link: https://datasheet.datasheetarchive.com/originals/distributors/DKDS-10/192395.pdf; Height: 1.8mm; Manufacturer_Part_Number: GRM31CR61H106MA12L; Mouser Part Number: 81-GRM31CR61H106MA2L; Mouser Price/Stock: https://www.mouser.co.uk/ProductDetail/Murata-Electronics/GRM31CR61H106MA12L/?qs=eeBpzGFlv%252B9KISFXBDHybg%3D%3D; Arrow Part Number: GRM31CR61H106MA12L; Arrow Price/Stock: https://www.arrow.com/en/products/grm31cr61h106ma12l/murata-manufacturing?region=europe; LCSC Part #: C882507
D1 = SM6T39A: Diode; Manufacturer_Name: STMicroelectronics; Datasheet Link: https://datasheet.datasheetarchive.com/originals/distributors/Datasheets-20/DSA-387610.pdf; Height: 2.65mm; Manufacturer_Part_Number: SM6T39A; Mouser Part Number: 511-SM6T39A; Mouser Price/Stock: https://www.mouser.co.uk/ProductDetail/STMicroelectronics/SM6T39A?qs=1tTY8DFIKACDikxFTWVTXw%3D%3D; Arrow Part Number: SM6T39A; Arrow Price/Stock: https://www.arrow.com/en/products/sm6t39a/stmicroelectronics
D10 = 30BQ015TR: Schottky Diode / 30BQ015TR; Manufacturer_Name: SMC Diode Solutions; Datasheet Link: http://www.smc-diodes.com/propdf/30BQ015%20N0025%20REV.A.pdf; Height: 2.95mm; Manufacturer_Part_Number: 30BQ015TR
D31A D31B D36A D36B = BAS3010A03WE6327HTSA1: Diode; Manufacturer_Name: Infineon; Datasheet Link: https://www.infineon.com/dgdl/Infineon-BAS3010ASERIES-DS-v01_01-en.pdf?fileId=db3a30431ddc9372011dfbc50f231c06; Height: 1.1mm; Manufacturer_Part_Number: BAS3010A03WE6327HTSA1; Mouser Part Number: 726-BAS3010A-03WE6; Mouser Price/Stock: https://www.mouser.co.uk/ProductDetail/Infineon-Technologies/BAS3010A03WE6327HTSA1?qs=K00xGehIljtEbk1%252B2pLZ%252BQ%3D%3D; Arrow Part Number: BAS3010A03WE6327HTSA1; Arrow Price/Stock: https://www.arrow.com/en/products/bas3010a03we6327htsa1/infineon-technologies-ag?region=nac
DC/DC3 DC/DC10 DC/DC15 = P783F-Q24-S12-S: Power Supply / P783F-Q24-S12-S; Manufacturer_Name: CUI Inc.; Datasheet Link: https://www.cui.com/product/resource/p783f-s.pdf; Height: 13mm; Manufacturer_Part_Number: P783F-Q24-S12-S; Mouser Part Number: 490-P783F-Q24-S12-S; Mouser Price/Stock: https://www.mouser.co.uk/ProductDetail/CUI-Inc/P783F-Q24-S12-S?qs=sPbYRqrBIVljRPgIyO3l8A%3D%3D
IC30 = TLC3702ID: Integrated Circuit; Manufacturer_Name: Texas Instruments; Datasheet Link: http://www.ti.com/lit/ds/symlink/tlc3702.pdf; Height: 1.75mm; Manufacturer_Part_Number: TLC3702ID; Mouser Part Number: 595-TLC3702ID; Mouser Price/Stock: https://www.mouser.co.uk/ProductDetail/Texas-Instruments/TLC3702ID?qs=N6WZOzgtpqUb%252BRDgy00dsg%3D%3D; Arrow Part Number: TLC3702ID; Arrow Price/Stock: https://www.arrow.com/en/products/tlc3702id/texas-instruments
J1 J2 = 1830184: Connector; Manufacturer_Name: Phoenix Contact; Datasheet Link: https://www.phoenixcontact.com/online/portal/us/?uri=pxc-oc-itemdetail:pid=1830184&library=usen&pcck=P-11-02-11&tab=1&selectedCategory=ALL; Height: 8.35mm; Manufacturer_Part_Number: 1830184; Mouser Part Number: 651-1830184; Mouser Price/Stock: https://www.mouser.co.uk/ProductDetail/Phoenix-Contact/1830184?qs=o1waKiAPAqfS6fAOQz7r2w%3D%3D; Arrow Part Number: 1830184; Arrow Price/Stock: https://www.arrow.com/en/products/1830184/phoenix-contact?region=nac
L15 = 74437346068: Inductor; Manufacturer_Name: Wurth Elektronik; Datasheet Link: https://katalog.we-online.com/pbs/datasheet/74437346068.pdf; Height: 3mm; Manufacturer_Part_Number: 74437346068; Mouser Part Number: 710-74437346068; Mouser Price/Stock: https://www.mouser.co.uk/ProductDetail/Wurth-Elektronik/74437346068?qs=cFlH0mFHHFr7wDblh%2FbjSQ%3D%3D
LED1 LED2 LED18 LED30 LED39 LED46 = KP-2012SGD: LED / KP-2012SGD / 0805; Manufacturer_Name: Kingbright; Datasheet Link: https://www.arrow.com/en/products/kp-2012sgd/kingbright; Height: 1.2mm; Manufacturer_Part_Number: KP-2012SGD; Mouser Part Number: N/A; Mouser Price/Stock: https://www.mouser.co.uk/ProductDetail/Kingbright/KP-2012SGD?qs=2JU0tDl2GZ3ofCdUidPmmg%3D%3D; Arrow Part Number: KP-2012SGD; Arrow Price/Stock: https://www.arrow.com/en/products/kp-2012sgd/kingbright
R1 R2 R18 R30 R39 R46 = CPF0805B100RE1: Resistor / CPF0805B100RE1 / 0805; Manufacturer_Name: TE Connectivity; Datasheet Link: https://datasheet.datasheetarchive.com/originals/distributors/DKDS-21/401696.pdf; Height: 0.65mm; Manufacturer_Part_Number: CPF0805B100RE1; Mouser Part Number: 279-CPF0805B100RE1; Mouser Price/Stock: https://www.mouser.co.uk/ProductDetail/TE-Connectivity-Holsworthy/CPF0805B100RE1?qs=9ylKvqdyudkCWLPT1QvLZQ%3D%3D; Arrow Part Number: CPF0805B100RE1; Arrow Price/Stock: https://www.arrow.com/en/products/cpf0805b100re1/te-connectivity?region=nac
R31-R37 R40-R43 = MCSR06X47R0FTL: Resistor / 0603; Manufacturer_Name: MULTICOMP; Datasheet Link: http://www.farnell.com/datasheets/1716710.pdf?_ga=1.256651403.1411154270.1472651675; Height: 0.6mm; Manufacturer_Part_Number: MCSR06X47R0FTL
R45 = ERJ-8BWFR075V: Resistor / 1206 / 33R 3W; Manufacturer_Name: Panasonic; Datasheet Link: http://industrial.panasonic.com/cdbs/www-data/pdf/RDN0000/AOA0000C313.pdf; Manufacturer_Part_Number: ERJ-8BWFR075V; Mouser Part Number: 667-ERJ-8BWFR075V; Mouser Price/Stock: https://www.mouser.co.uk/ProductDetail/Panasonic/ERJ-8BWFR075V?qs=KH2o3k57USiX44P74%2FQfRA%3D%3D; Arrow Part Number: ERJ-8BWFR075V; Arrow Price/Stock: https://www.arrow.com/en/products/erj-8bwfr075v/panasonic; LCSC Part #: *
S1 = 1-1825137-1: Switch single pole single throw; Manufacturer_Name: TE Connectivity; Datasheet Link: https://www.mouser.com/datasheet/2/418/NG_CD_1825137_A7_baseFilename-660113.pdf; Height: 28.194mm; Manufacturer_Part_Number: 1-1825137-1; Mouser Part Number: N/A; Mouser Price/Stock: https://www.mouser.com/Search/Refine.aspx?Keyword=N%2FA
T40 T42 = BCR135WH6327XTSA1: Digitaltransistor, npn, 50V, 100mA, SOT23; Manufacturer_Name: Infineon; Datasheet Link: https://componentsearchengine.com/Datasheets/1/BCR135WH6327XTSA1.pdf; Height: 1mm; Manufacturer_Part_Number: BCR135WH6327XTSA1; Mouser Part Number: 726-BCR135WH6327XTSA; Mouser Price/Stock: https://www.mouser.com/Search/Refine.aspx?Keyword=726-BCR135WH6327XTSA; Arrow Part Number: BCR135WH6327XTSA1; Arrow Price/Stock: https://www.arrow.com/en/products/bcr135wh6327xtsa1/infineon-technologies-ag
T41 = AO3407A: MOS-FET, p-Kanal, -40  V, -3,4 A, SOT23; Manufacturer_Name: Alpha & Omega Semiconductors; Datasheet Link: http://www.aosmd.com/pdfs/datasheet/ao3407a.pdf; Height: 1.25mm; Manufacturer_Part_Number: AO3407A; Arrow Part Number: AO3407A; Arrow Price/Stock: https://www.arrow.com/en/products/ao3407a/alpha-and-omega-semiconductor?region=nac
T43 = AUIRF9Z34N: MOS-FET, p-Kanal, -40  V, -120 A, TO220; Manufacturer_Name: Infineon; Datasheet Link: https://www.infineon.com/dgdl/auirf9z34n.pdf?fileId=5546d462533600a4015355b0fd23141c; Height: 4.82mm; Manufacturer_Part_Number: AUIRF9Z34N; Mouser Part Number: 942-AUIRF9Z34N; Mouser Price/Stock: https://www.mouser.com/Search/Refine.aspx?Keyword=942-AUIRF9Z34N; Arrow Part Number: AUIRF9Z34N; Arrow Price/Stock: https://www.arrow.com/en/products/auirf9z34n/infineon-technologies-ag
TR10 = 1.5SMC15A: Überspannungsdiode, 30 V, 3000 W, DO214-AB, unidirektional, SMD; Manufacturer_Name: LITTELFUSE; Datasheet Link: https://componentsearchengine.com/Datasheets/2/1.5SMC15A.pdf; Height: 2.62mm; Manufacturer_Part_Number: 1.5SMC15A; Mouser Part Number: 576-1.5SMC15A; Mouser Price/Stock: https://www.mouser.co.uk/ProductDetail/Littelfuse/15SMC15A?qs=JJML70Qc14sYvtvez3q0iw%3D%3D
ZD40 ZD42 = LS4150GS08: SOD-80 / ZMM 15, 5%; Manufacturer_Name: Vishay; Datasheet Link: https://www.vishay.com/docs/85562/ls4150.pdf; Height: 1mm; Manufacturer_Part_Number: LS4150GS08; Mouser Part Number: 78-LS4150; Mouser Price/Stock: https://www.mouser.co.uk/ProductDetail/Vishay-Semiconductors/LS4150GS08?qs=RzxYCzJDjPXu3Zrfu5SCoA%3D%3D

## Sheet motor subsheet 1.SchDoc
size A3
Used 2 times, as channels Motor 2, Motor 1 (ref). Parts and nets are listed once, with the designators drawn on the sheet.
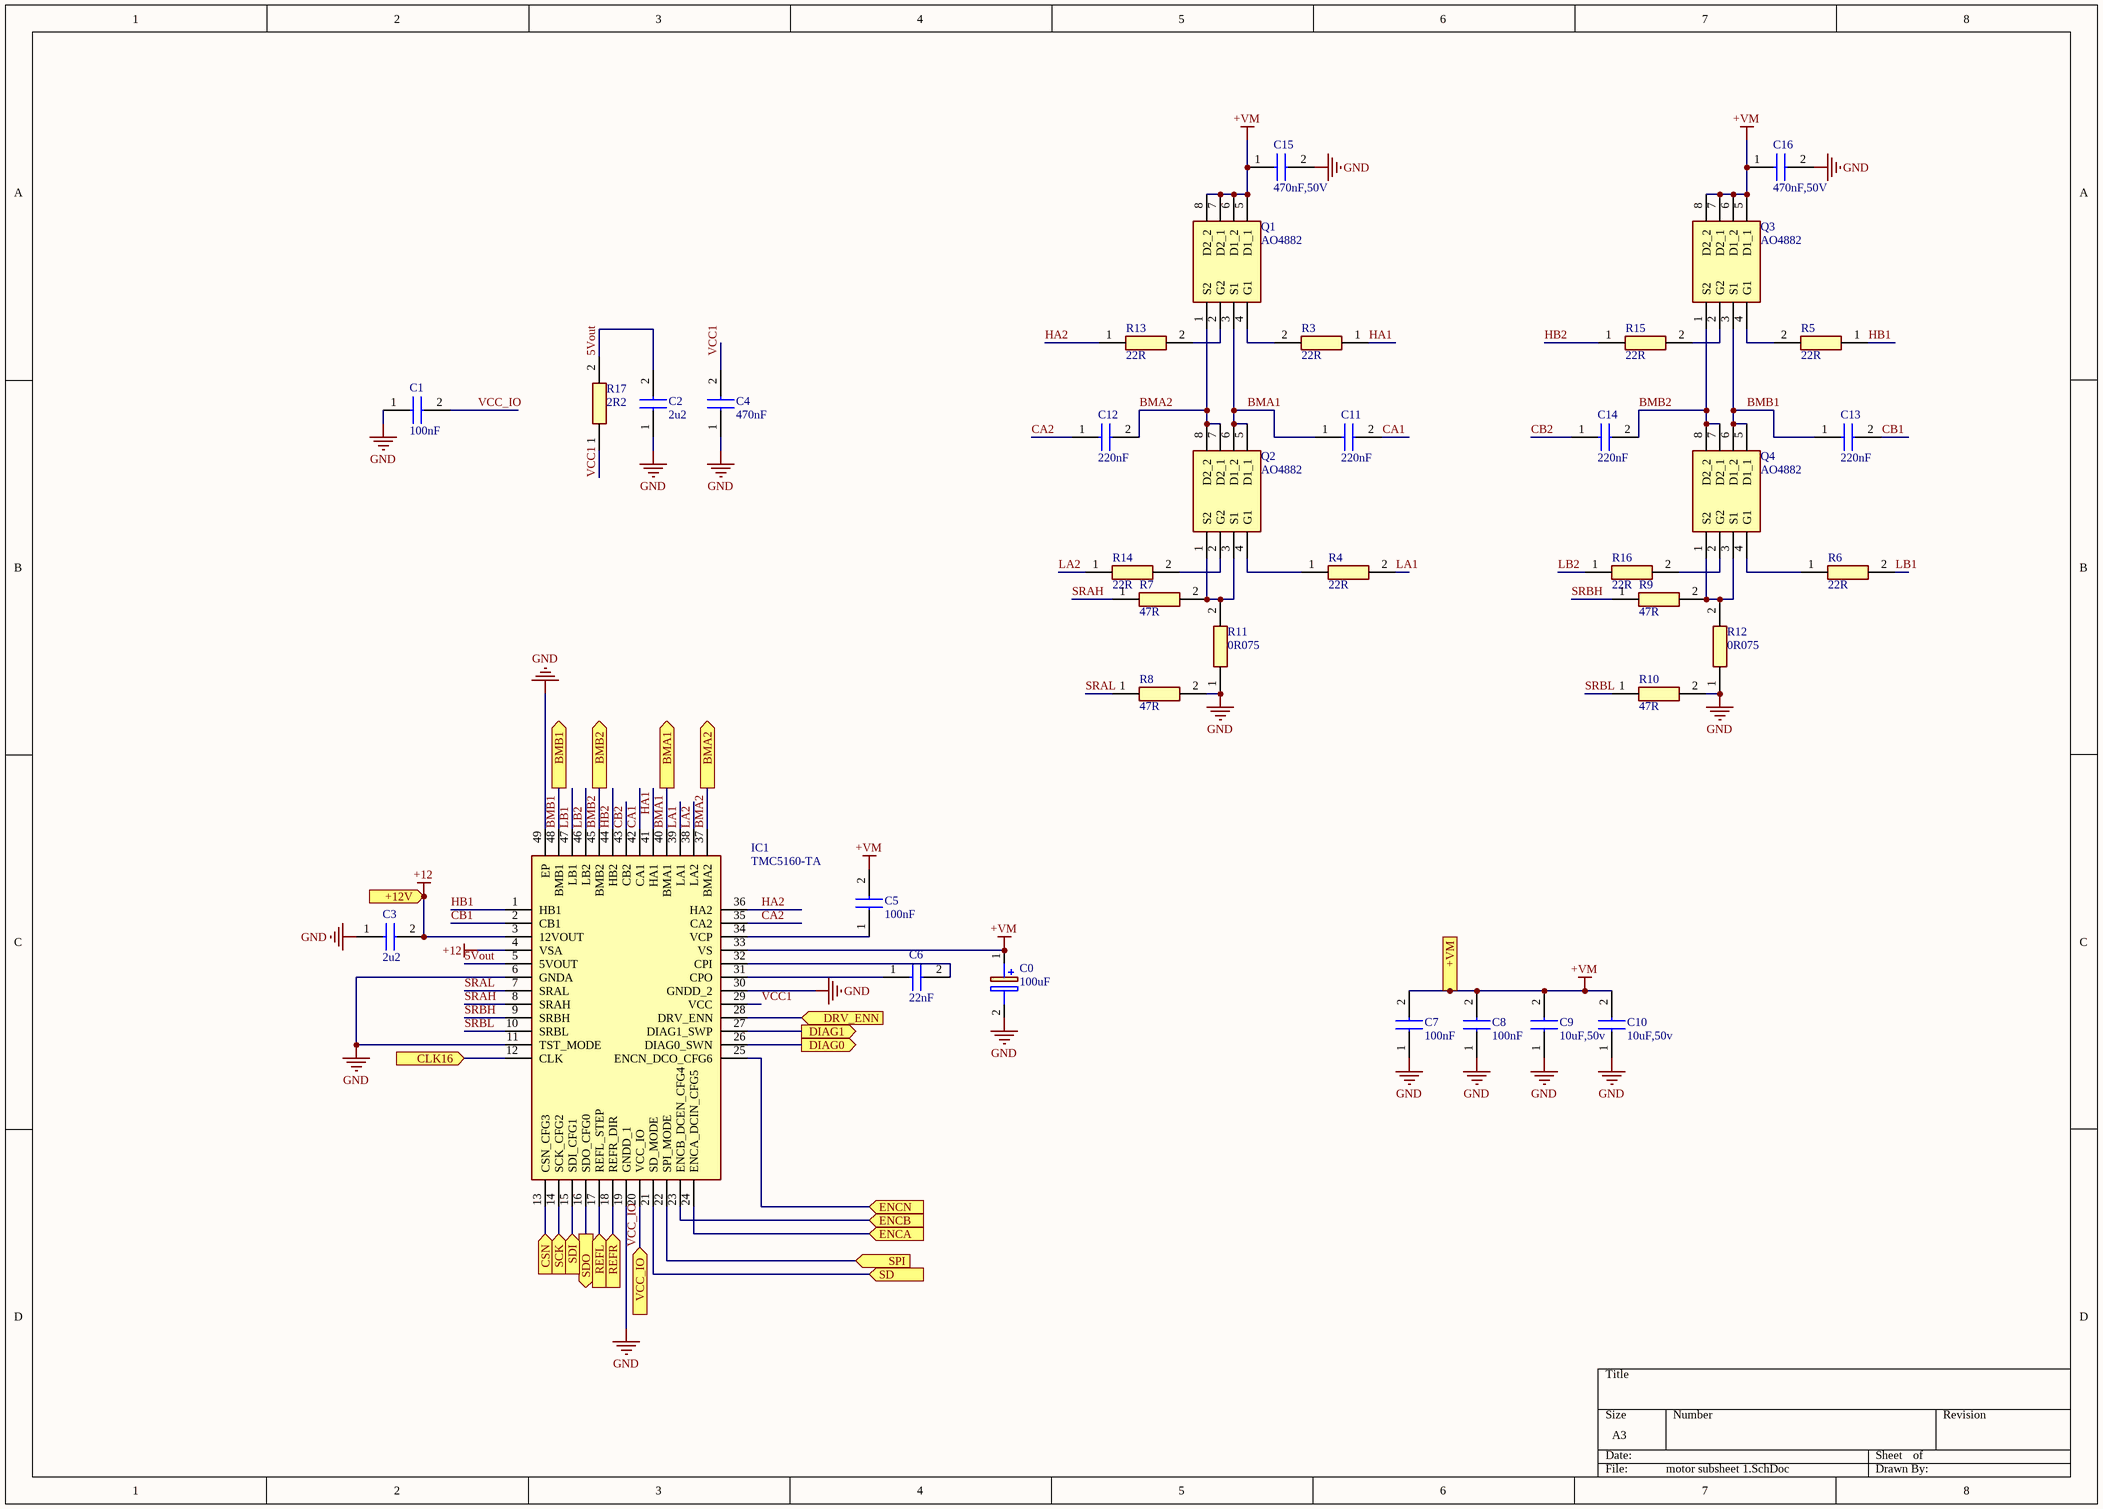
[diagram p4: motor subsheet 1.SchDoc]

### Parts
C0  100uF  [CAPAE850X1050N]
C1  100nF  [CAPC1608X90N]
C2  2u2  [CAPC1608X90N]
C3  2u2  [CAPC1608X90N]
C4  470nF  [CAPC1608X90N]
C5  100nF  [CAPC1608X90N]
C6  22nF  [CAPC1608X90N]
C7  100nF  [CAPC1608X90N]
C8  100nF  [CAPC1608X90N]
C9  10uF,50v  [CAPC3216X180N]
C10  10uF,50v  [CAPC3216X180N]
C11  220nF  [CAPC1608X90N]
C12  220nF  [CAPC1608X90N]
C13  220nF  [CAPC1608X90N]
C14  220nF  [CAPC1608X90N]
C15  470nF,50V  [C1608_Commercial]
C16  470nF,50V  [C1608_Commercial]
IC1  TMC5160-TA  [QFP50P900X900X120-49N]
Q1  AO4882  [SOIC127P600X175-8N]
Q2  AO4882  [SOIC127P600X175-8N]
Q3  AO4882  [SOIC127P600X175-8N]
Q4  AO4882  [SOIC127P600X175-8N]
R3  22R  [RESC1608X55N]
R4  22R  [RESC1608X55N]
R5  22R  [RESC1608X55N]
R6  22R  [RESC1608X55N]
R7  47R  [RESC1608X60N]
R8  47R  [RESC1608X60N]
R9  47R  [RESC1608X60N]
R10  47R  [RESC1608X60N]
R11  0R075  [ERJ8_B_BW_R_LW_CW_D]
R12  0R075  [ERJ8_B_BW_R_LW_CW_D]
R13  22R  [RESC1608X55N]
R14  22R  [RESC1608X55N]
R15  22R  [RESC1608X55N]
R16  22R  [RESC1608X55N]
R17  2R2  [RESC1608X55N]

### Ports
+12V (in), +VM (in), BMA1 (out), BMA2 (out), BMB1 (out), BMB2 (out), CLK16 (in), CSN (in), DIAG0 (out), DIAG1 (out), DRV_ENN (in), ENCA (in), ENCB (in), ENCN (in), REFL (in), REFR (in), SCK (in), SD (in), SDI (in), SDO (out), SPI (in), VCC_IO (in)

### Nets
+12: C3.2 IC1.3(12VOUT) IC1.4(VSA) ; port +12V
+VM: C0.1(+) C5.2 C7.2 C8.2 C9.2 C10.2 C15.1 C16.1 IC1.33(VS) Q1.5(D1_1) Q1.6(D1_2) Q1.7(D2_1) Q1.8(D2_2) Q3.5(D1_1) Q3.6(D1_2) Q3.7(D2_1) Q3.8(D2_2) ; port +VM
GND: C0.2(-) C1.1 C2.1 C3.1 C4.1 C7.1 C8.1 C9.1 C10.1 C15.2 C16.2 IC1.6(GNDA) IC1.11(TST_MODE) IC1.19(GNDD_1) IC1.30(GNDD_2) IC1.49(EP) R8.2 R10.2 R11.1 R12.1
5Vout: C2.2 IC1.5(5VOUT) R17.2
BMA1: C11.1 IC1.40(BMA1) Q1.3(S1) Q2.5(D1_1) Q2.6(D1_2) ; port BMA1
BMA2: C12.2 IC1.37(BMA2) Q1.1(S2) Q2.7(D2_1) Q2.8(D2_2) ; port BMA2
BMB1: C13.1 IC1.48(BMB1) Q3.3(S1) Q4.5(D1_1) Q4.6(D1_2) ; port BMB1
BMB2: C14.2 IC1.45(BMB2) Q3.1(S2) Q4.7(D2_1) Q4.8(D2_2) ; port BMB2
CA1: C11.2 IC1.42(CA1)
CA2: C12.1 IC1.35(CA2)
CB1: C13.2 IC1.2(CB1)
CB2: C14.1 IC1.43(CB2)
CLK16: IC1.12(CLK) ; port CLK16
CSN: IC1.13(CSN_CFG3) ; port CSN
DIAG0: IC1.26(DIAG0_SWN) ; port DIAG0
DIAG1: IC1.27(DIAG1_SWP) ; port DIAG1
DRV_ENN: IC1.28(DRV_ENN) ; port DRV_ENN
ENCA: IC1.24(ENCA_DCIN_CFG5) ; port ENCA
ENCB: IC1.23(ENCB_DCEN_CFG4) ; port ENCB
ENCN: IC1.25(ENCN_DCO_CFG6) ; port ENCN
HA1: IC1.41(HA1) R3.1
HA2: IC1.36(HA2) R13.1
HB1: IC1.1(HB1) R5.1
HB2: IC1.44(HB2) R15.1
LA1: IC1.39(LA1) R4.2
LA2: IC1.38(LA2) R14.1
LB1: IC1.47(LB1) R6.2
LB2: IC1.46(LB2) R16.1
REFL: IC1.17(REFL_STEP) ; port REFL
REFR: IC1.18(REFR_DIR) ; port REFR
SCK: IC1.14(SCK_CFG2) ; port SCK
SD: IC1.21(SD_MODE) ; port SD
SDI: IC1.15(SDI_CFG1) ; port SDI
SDO: IC1.16(SDO_CFG0) ; port SDO
SPI: IC1.22(SPI_MODE) ; port SPI
SRAH: IC1.8(SRAH) R7.1
SRAL: IC1.7(SRAL) R8.1
SRBH: IC1.9(SRBH) R9.1
SRBL: IC1.10(SRBL) R10.1
VCC1: C4.2 IC1.29(VCC) R17.1
VCC_IO: C1.2 IC1.20(VCC_IO) ; port VCC_IO
NetC5_1: C5.1 IC1.34(VCP)
NetC6_1: C6.1 IC1.31(CPO)
NetC6_2: C6.2 IC1.32(CPI)
NetQ1_2: Q1.2(G2) R13.2
NetQ1_4: Q1.4(G1) R3.2
NetQ2_1: Q2.1(S2) Q2.3(S1) R7.2 R11.2
NetQ2_2: Q2.2(G2) R14.2
NetQ2_4: Q2.4(G1) R4.1
NetQ3_2: Q3.2(G2) R15.2
NetQ3_4: Q3.4(G1) R5.2
NetQ4_1: Q4.1(S2) Q4.3(S1) R9.2 R12.2
NetQ4_2: Q4.2(G2) R16.2
NetQ4_4: Q4.4(G1) R6.1

### Channels
Motor 2: designators end in A; ports +12V=VCC+12V +VM=+VM BMA1=BMA1 BMA2=BMA2 BMB1=BMB1 BMB2=BMB2 CLK16=CLK16 CSN=CSN2 DIAG0=Net2_1 DIAG1=Net2_2 DRV_ENN=DRV_ENN ENCA=NetIC1A_24 ENCB=NetIC1A_23 ENCN=NetIC1A_25 REFL=REFL2 REFR=REFR2 SCK=SCK SD=SD SDI=SDI SDO=SDO SPI=SPI VCC_IO=VCC_IO
Motor 1 (ref): designators end in B; ports +12V=VCC+12V +VM=+VM BMA1=BMA1 BMA2=BMA2 BMB1=BMB1 BMB2=BMB2 CLK16=CLK16 CSN=CSN3 DIAG0=Net3_1 DIAG1=Net3_2 DRV_ENN=DRV_ENN ENCA=NetIC1B_24 ENCB=NetIC1B_23 ENCN=NetIC1B_25 REFL=REFL3 REFR=REFR3 SCK=SCK SD=GND SDI=SDI SDO=SDO SPI=VCC_IO VCC_IO=VCC_IO

### Library data of the parts
C0 = MAL215097011E3: as C0 on sheet PCB Motor Sheet1; Datasheet Link: http://www.vishay.com/docs/28395/150crz.pdf; Height: 10.5mm; Manufacturer_Part_Number: MAL215097011E3; Mouser Part Number: 594-MAL215097011E3; Mouser Price/Stock: https://www.mouser.co.uk/ProductDetail/Vishay-BC-Components/MAL215097011E3?qs=qmStTZH4TzmmMfVG5I6TQQ%3D%3D; Arrow Part Number: MAL215097011E3; Arrow Price/Stock: https://www.arrow.com/en/products/mal215097011e3/vishay
C1-C8 C11-C14 = GCM188R71H224KA64D: as C1 on sheet PCB Motor Sheet1; Datasheet Link: https://psearch.en.murata.com/capacitor/product/GCM188R71H224KA64%23.html; Height: 0.9mm; Manufacturer_Part_Number: GCM188R71H224KA64D; Mouser Part Number: 81-GCM188R71H224K64D; Mouser Price/Stock: https://www.mouser.co.uk/ProductDetail/Murata-Electronics/GCM188R71H224KA64D?qs=Kk8YaIHLBVBgtUYYs%2FZrtQ%3D%3D; Arrow Part Number: GCM188R71H224KA64D; Arrow Price/Stock: https://www.arrow.com/en/products/gcm188r71h224ka64d/murata-manufacturing
  C1 C5 C7 C8: LCSC Part #: C161181
  C2: LCSC Part #: C77047
  C3: LCSC Part #: *
  C4: LCSC Part #: C170149
  C6: LCSC Part #: C354353
  C11-C14: LCSC Part #: C97857
C9 C10 = GRM31CR61H106MA12L: as C9 on sheet PCB Motor Sheet1; Datasheet Link: https://datasheet.datasheetarchive.com/originals/distributors/DKDS-10/192395.pdf; Height: 1.8mm; Manufacturer_Part_Number: GRM31CR61H106MA12L; Mouser Part Number: 81-GRM31CR61H106MA2L; Mouser Price/Stock: https://www.mouser.co.uk/ProductDetail/Murata-Electronics/GRM31CR61H106MA12L/?qs=eeBpzGFlv%252B9KISFXBDHybg%3D%3D; Arrow Part Number: GRM31CR61H106MA12L; Arrow Price/Stock: https://www.arrow.com/en/products/grm31cr61h106ma12l/murata-manufacturing?region=europe; LCSC Part #: C882507
C15 C16 = C1608X7R1H474K080AC: Capacitor; Manufacturer_Name: TDK; Datasheet Link: https://product.tdk.com/system/files/dam/doc/product/capacitor/ceramic/mlcc/catalog/mlcc_commercial_general_en.pdf; Height: 0.9mm; Manufacturer_Part_Number: C1608X7R1H474K080AC; Mouser Part Number: 810-C1608X7R1H474K; Mouser Price/Stock: https://www.mouser.co.uk/ProductDetail/TDK/C1608X7R1H474K080AC?qs=NRhsANhppD8WKA9kPBtdag%3D%3D; LCSC Part #: C170149
IC1 = TMC5160-TA: as IC1 on sheet PCB Motor Sheet1; Datasheet Link: https://datasheet.datasheetarchive.com/originals/distributors/DKDS-40/47761.pdf; Height: 1.2mm; Manufacturer_Part_Number: TMC5160-TA; LCSC Part #: C516354
Q1-Q4 = AO4882: as Q1 on sheet PCB Motor Sheet1; Datasheet Link: http://www.aosmd.com/res/data_sheets/AO4882.pdf; Height: 1.75mm; Manufacturer_Part_Number: AO4882; Arrow Part Number: AO4882; Arrow Price/Stock: https://www.arrow.com/en/products/ao4882/alpha-and-omega-semiconductor?region=nac; LCSC Part #: C3040598
R3-R6 R13-R17 = MC0063W06031100K: Resistor; Manufacturer_Name: MULTICOMP; Datasheet Link: http://uk.farnell.com/multicomp/mc0063w06031105k/res-thick-film-105k-1-0-063w-0603/dp/1170988; Height: 0.55mm; Manufacturer_Part_Number: MC0063W06031100K
  R3-R6 R13-R16: LCSC Part #: C122707
  R17: LCSC Part #: C269422
R7-R10 = MCSR06X47R0FTL: Resistor; Manufacturer_Name: MULTICOMP; Datasheet Link: http://www.farnell.com/datasheets/1716710.pdf?_ga=1.256651403.1411154270.1472651675; Height: 0.6mm; Manufacturer_Part_Number: MCSR06X47R0FTL; LCSC Part #: C2136913
R11 R12 = ERJ-8BWFR075V: Resistor; Manufacturer_Name: Panasonic; Datasheet Link: http://industrial.panasonic.com/cdbs/www-data/pdf/RDN0000/AOA0000C313.pdf; Manufacturer_Part_Number: ERJ-8BWFR075V; Mouser Part Number: 667-ERJ-8BWFR075V; Mouser Price/Stock: https://www.mouser.co.uk/ProductDetail/Panasonic/ERJ-8BWFR075V?qs=KH2o3k57USiX44P74%2FQfRA%3D%3D; Arrow Part Number: ERJ-8BWFR075V; Arrow Price/Stock: https://www.arrow.com/en/products/erj-8bwfr075v/panasonic; LCSC Part #: C388441

## Nets that join several sheets
+VM: Motor Driver SCH 1 (24 pins), PCB Motor Sheet1 (17 pins), 4th driver (C7C.2 C8C.2 C9C.2 C10C.2), Complete Power Supply (+Motor.25 R45.2 R46.2 T43.2), Motor 2 (17 pins), Motor 1 (ref) (17 pins)
GND: Motor Driver SCH 1 (54 pins), PCB Motor Sheet1 (20 pins), 4th driver (14 pins), Complete Power Supply (47 pins), Motor 2 (20 pins), Motor 1 (ref) (21 pins)
VCC+3.3V: Motor Driver SCH 1 (12 pins), Complete Power Supply (9 pins)
VCC+5V: Motor Driver SCH 1 (12 pins), Complete Power Supply (13 pins)
VCC+12V: Motor Driver SCH 1 (12 pins), PCB Motor Sheet1 (C3.2 IC1.3 IC1.4), 4th driver (C3C.2 IC1C.3 IC1C.4), Complete Power Supply (7 pins), Motor 2 (C3A.2 IC1A.3 IC1A.4), Motor 1 (ref) (C3B.2 IC1B.3 IC1B.4)
BMA1: Motor Driver SCH 1 (M3.3), Motor 1 (ref) (5 pins)
BMA1: Motor Driver SCH 1 (M1.3), PCB Motor Sheet1 (5 pins)
BMA1: Motor Driver SCH 1 (M2.3), Motor 2 (5 pins)
BMA2: Motor Driver SCH 1 (M3.4), Motor 1 (ref) (5 pins)
BMA2: Motor Driver SCH 1 (M1.4), PCB Motor Sheet1 (5 pins)
BMA2: Motor Driver SCH 1 (M2.4), Motor 2 (5 pins)
BMB1: Motor Driver SCH 1 (M3.1), Motor 1 (ref) (5 pins)
BMB1: Motor Driver SCH 1 (M1.1), PCB Motor Sheet1 (5 pins)
BMB1: Motor Driver SCH 1 (M2.1), Motor 2 (5 pins)
BMB2: Motor Driver SCH 1 (M3.2), Motor 1 (ref) (5 pins)
BMB2: Motor Driver SCH 1 (M1.2), PCB Motor Sheet1 (5 pins)
BMB2: Motor Driver SCH 1 (M2.2), Motor 2 (5 pins)
CLK16: Motor Driver SCH 1 (100.A17), PCB Motor Sheet1 (IC1.12), 4th driver (IC1C.12), Motor 2 (IC1A.12), Motor 1 (ref) (IC1B.12)
CSN1: Motor Driver SCH 1 (100.A11), PCB Motor Sheet1 (IC1.13)
CSN2: Motor Driver SCH 1 (100.A16), Motor 2 (IC1A.13)
CSN3: Motor Driver SCH 1 (100.A3), Motor 1 (ref) (IC1B.13)
CSN4: Motor Driver SCH 1 (100.A18), 4th driver (IC1C.13)
DIAG0: Motor Driver SCH 1 (100.D10), 4th driver (IC1C.26)
DIAG1: Motor Driver SCH 1 (100.D11), 4th driver (IC1C.27)
DRV_ENN: Motor Driver SCH 1 (100.A14), PCB Motor Sheet1 (IC1.28), 4th driver (IC1C.28), Motor 2 (IC1A.28), Motor 1 (ref) (IC1B.28)
I2C_SCL: Motor Driver SCH 1 (100.D6 100.D7), Complete Power Supply (J1.4 J2.4)
I2C_SDA: Motor Driver SCH 1 (100.D3 100.D4), Complete Power Supply (J1.3 J2.3)
Net1_1: Motor Driver SCH 1 (1.1), PCB Motor Sheet1 (IC1.26)
Net1_2: Motor Driver SCH 1 (1.2), PCB Motor Sheet1 (IC1.27)
Net2_1: Motor Driver SCH 1 (2.1), Motor 2 (IC1A.26)
Net2_2: Motor Driver SCH 1 (2.2), Motor 2 (IC1A.27)
Net3_1: Motor Driver SCH 1 (3.1), Motor 1 (ref) (IC1B.26)
Net3_2: Motor Driver SCH 1 (3.2), Motor 1 (ref) (IC1B.27)
NetIC1_23: Motor Driver SCH 1 (M1.1.4), PCB Motor Sheet1 (IC1.23)
NetIC1_24: Motor Driver SCH 1 (M1.1.3), PCB Motor Sheet1 (IC1.24)
NetIC1_25: Motor Driver SCH 1 (M1.1.2), PCB Motor Sheet1 (IC1.25)
NetIC1A_23: Motor Driver SCH 1 (M2.2.3), Motor 2 (IC1A.23)
NetIC1A_24: Motor Driver SCH 1 (M2.2.2), Motor 2 (IC1A.24)
NetIC1A_25: Motor Driver SCH 1 (M2.2.1), Motor 2 (IC1A.25)
NetIC1B_23: Motor Driver SCH 1 (M3.3.3), Motor 1 (ref) (IC1B.23)
NetIC1B_24: Motor Driver SCH 1 (M3.3.2), Motor 1 (ref) (IC1B.24)
NetIC1B_25: Motor Driver SCH 1 (M3.3.1), Motor 1 (ref) (IC1B.25)
REFL1: Motor Driver SCH 1 (S5.2), PCB Motor Sheet1 (IC1.17)
REFL2: Motor Driver SCH 1 (S7.2), Motor 2 (IC1A.17)
REFL3: Motor Driver SCH 1 (S3.1), Motor 1 (ref) (IC1B.17)
REFL4: Motor Driver SCH 1 (100.D8), 4th driver (IC1C.17)
REFR1: Motor Driver SCH 1 (S5.5), PCB Motor Sheet1 (IC1.18)
REFR2: Motor Driver SCH 1 (S7.5), Motor 2 (IC1A.18)
REFR3: Motor Driver SCH 1 (S3.3), Motor 1 (ref) (IC1B.18)
REFR4: Motor Driver SCH 1 (100.D9), 4th driver (IC1C.18)
SCK: Motor Driver SCH 1 (100.A19), PCB Motor Sheet1 (IC1.14), 4th driver (IC1C.14), Motor 2 (IC1A.14), Motor 1 (ref) (IC1B.14)
SD: Motor Driver SCH 1 (S4.2), PCB Motor Sheet1 (IC1.21), Motor 2 (IC1A.21)
SDI: Motor Driver SCH 1 (100.A15), PCB Motor Sheet1 (IC1.15), 4th driver (IC1C.15), Motor 2 (IC1A.15), Motor 1 (ref) (IC1B.15)
SDO: Motor Driver SCH 1 (100.A6), PCB Motor Sheet1 (IC1.16), 4th driver (IC1C.16), Motor 2 (IC1A.16), Motor 1 (ref) (IC1B.16)
SPI: Motor Driver SCH 1 (S4.5), PCB Motor Sheet1 (IC1.22), Motor 2 (IC1A.22)
VCC_IO: Motor Driver SCH 1 (S4.3 S4.4), PCB Motor Sheet1 (C1.2 IC1.20), 4th driver (C1C.2 IC1C.20 IC1C.22), Motor 2 (C1A.2 IC1A.20), Motor 1 (ref) (C1B.2 IC1B.20 IC1B.22)